# Altium project PCB.PrjPcb (part 1 of 2)
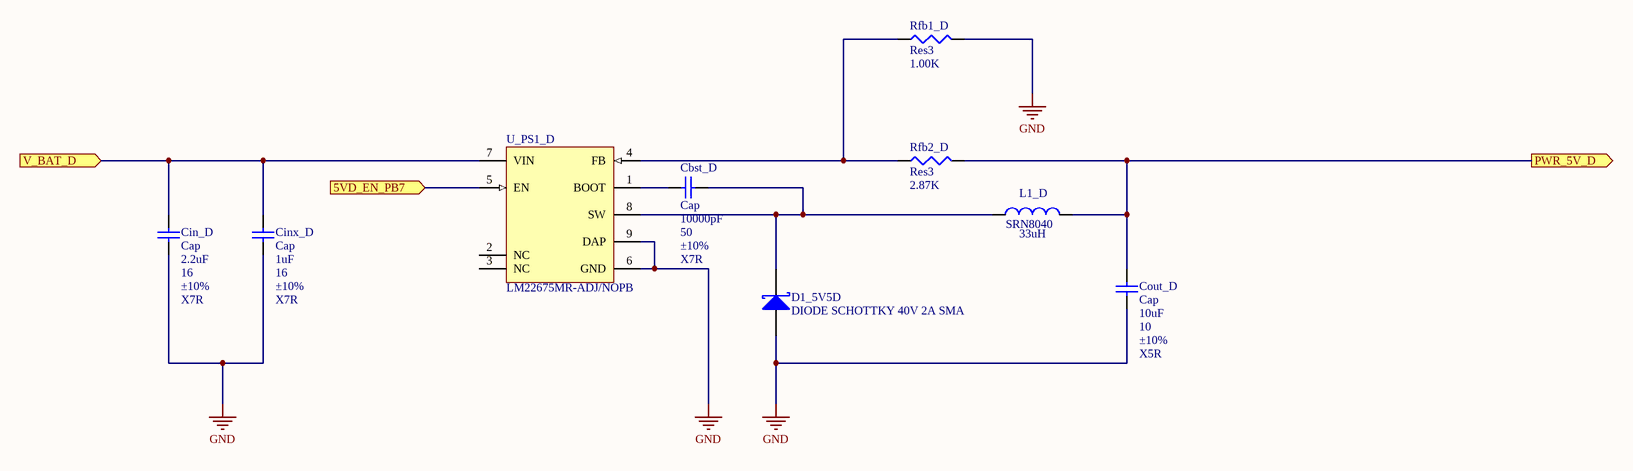
[diagram p0: SMPS_5V_D.SchDoc]
12 sheets, 134 parts. Net scope: hierarchical (ports join the sheet entries above them; power ports are global).
Board file: PCB1.PcbDoc
Sheets:
  SMPS_5V_D.SchDoc
  SMPS_5V_A.SchDoc
  Hierarchical_Design.SchDoc
    MCU = CPU.SchDoc
    Designator = RS3232.SchDoc
  StepperMotor1CTRL.SchDoc
  LCD_Header.SchDoc
  DCMotor1CTRL.SchDoc
  Encoder_DC_Mot.SchDoc
  LVR_3V3_PS.SchDoc
  Accelerometer.SchDoc
  DAC.SchDoc

## Sheet SMPS_5V_D.SchDoc: SMPS 5V Using LM22675
size B; Date: 2015-01-16; Author: Marcin Czajkowski; CompanyName: Conestoga College; DrawnBy: Marcin Czajkowski; Organization: Conestoga College; Address1: SN: 3547684; Address2: ESE-Y2; Address3: Conestoga College; Address4: Project IV; DocumentNumber: 1; Revision: A; SheetNumber: 3; SheetTotal: 14; ProjectName: SMPS 5V Using LM22675

### Parts
Cbst_D  Cap  value 10000pF  WV: 50  Tolerance: ±10%  Type: X7R  [CAPC2012X09M]
Cin_D  Cap  value 2.2uF  WV: 16  Tolerance: ±10%  Type: X7R  [CAPC2012X09M]
Cinx_D  Cap  value 1uF  WV: 16  Tolerance: ±10%  Type: X7R  [CAPC2012X09M]
Cout_D  Cap  value 10uF  WV: 10  Tolerance: ±10%  Type: X5R  [CAPC2012X09M]
D1_5V5D  DIODE SCHOTTKY 40V 2A SMA  [DIOM4326X23M]
L1_D  SRN8040  Val: 33uH  [INDP8080X40M]
Rfb1_D  Res3  value 1.00K  [RESC2112X05M]
Rfb2_D  Res3  value 2.87K  [RESC2112X05M]
U_PS1_D  LM22675MR-ADJ/NOPB  [MRA08B_L]

### Ports
5VD_EN_PB7 (in), PWR_5V_D (out), V_BAT_D (in)

### Nets
GND: Cin_D.1 Cinx_D.1 Cout_D.1 D1_5V5D.2(A) Rfb1_D.2 U_PS1_D.6(GND) U_PS1_D.9(DAP)
NetCbst_D_1: Cbst_D.1 U_PS1_D.1(BOOT)
NetCbst_D_2: Cbst_D.2 D1_5V5D.1(K) L1_D.1 U_PS1_D.8(SW)
NetCin_D_2: Cin_D.2 Cinx_D.2 U_PS1_D.7(VIN) ; port V_BAT_D
NetCout_D_2: Cout_D.2 L1_D.2 Rfb2_D.2 ; port PWR_5V_D
NetRfb1_D_1: Rfb1_D.1 Rfb2_D.1 U_PS1_D.4(FB)
NetU_PS1_D_5: U_PS1_D.5(EN) ; port 5VD_EN_PB7

Not connected (* = marked no-connect by the designer): U_PS1_D 2(NC) 3(NC)

### Notes on the sheet
- ESE
- is the sole property of ESE. Any reproduction
- The Information Contained in this drawing
- Schematic P/N and Name
- Sheet Name
- 299 Doon Valley Drive
- Kitchener, ON N2G 4M4
- Canada
- Approved
- in part or in whole without the written
- permission of ESE is strictly prohibited.
- APPROVALS
- DATE
- Size
- Scale
- B
- NTS
- Bare PCB P/N
- Date
- Sheet
- Rev.
- Checked
- Engineer
- of

### Library data of the parts
Cbst_D = CAP-X7R-10000pF-50V-±10%: CAP CER 10000pF 50v X7R 0805; MPN: C0805C103K5RACTU; PN: 399-1158-1-ND; Name: CAP-X7R-10000pF-50V-±10%; URL: http://www.digikey.ca/product-detail/en/C0805C103K5RACTU/399-1158-1-ND
Cin_D = CAP-X7R-2.2uF-16V-±10%: CAP CER 2.2uF 16v X7R 0805; MPN: C0805C225K4RACTU; PN: 399-3523-1-ND; Name: CAP-X7R-2.2uF-16V-±10%; URL: http://www.digikey.ca/product-detail/en/C0805C225K4RACTU/399-3523-1-ND
Cinx_D = CAP-X7R-1uF-16V-±10%: CAP CER 1uF 16v X7R 0805; MPN: C0805C105K4RACTU; PN: 399-1284-1-ND; Name: CAP-X7R-1uF-16V-±10%; URL: http://www.digikey.ca/product-detail/en/C0805C105K4RACTU/399-1284-1-ND
Cout_D = CAP-X5R-10uF-10V-±10%: CAP CER 10uF 10v X5R 0805; MPN: C0805C106K8PACTU; PN: 399-4925-1-ND; Name: CAP-X5R-10uF-10V-±10%; URL: http://www.digikey.ca/product-detail/en/C0805C106K8PACTU/399-4925-1-ND
D1_5V5D = DIODE SCHOTTKY 40V 2A SMA: Schottky Rectifier; MPN: B240A-13-F; PN: B240A-FDICT-ND; URL: http://www.digikey.ca/product-detail/en/B240A-13-F/B240A-FDICT-ND
L1_D = SRN8040: FIXED IND 33UH 1.7A 145 MOHM SMD; MPN: SRN8040-220M; PN: SRN8040-330MCT-ND; URL: http://www.digikey.ca/product-detail/en/SRN8040-330M/SRN8040-330MCT-ND/2756183
Rfb1_D = Resistor_1.00K: RES SMD 1.00K OHM 1% 1/8W 0805; MPN: CRCW08051K00FKEA; PN: 541-1.00KCCT-ND; Name: Resistor_1.00K; URL: http://www.digikey.ca/product-detail/en/CRCW08051K00FKEA/541-1.00KCCT-ND
Rfb2_D = Resistor_2.87K: RES SMD 2.87K OHM 1% 1/8W 0805; MPN: CRCW08052K87FKEA; PN: 541-2.87KCCT-ND; Name: Resistor_2.87K; URL: http://www.digikey.ca/product-detail/en/CRCW08052K87FKEA/541-2.87KCCT-ND
U_PS1_D = LM22675MR-ADJ/NOPB: 1A SIMPLE SWITCHER®, Step-Down Voltage Regulator with Precision Enable, 8-pin PSOP, Pb-Free; Manufacturer: National Semiconductor; MPN: LM22675MRE-ADJ/NOPB; PackageTopMarking: NSXYTT*L22675*ADJ; PowerWise: N; High-Reliability: Y; PN: LM22675MRE-ADJ/NOPBCT-ND; DatasheetVersion: Dec-2010; PackageVersion: revB, Dec-2007; PackageReference: MRA08B; PackageDescription: Molded, PSOP .193 x .154 x .058in, 8 Lead, .050in Pitch, Large DAP; PartNumber: LM22675MR-ADJ/NOPB; RoHS: Y; PinCount: 8; CompType: Switcher; Code_JEDEC: MS-012-AA; ComponentLink1Description: Manufacturer URL; ComponentLink1URL: http://www.national.com/; ComponentLink2Description: LM22675 Datasheet; ComponentLink2URL: http://www.national.com/ds/LM/LM22675.pdf; ComponentLink3Description: LM22675 Web Page; ComponentLink3URL: http://www.national.com/pf/LM/LM22675.html; ComponentLink4Description: MRA08B Package Page; ComponentLink4URL: http://www.national.com/packaging/folders/mra08b.html; URL: http://www.digikey.ca/product-detail/en/LM22675MRE-ADJ%2FNOPB/LM22675MRE-ADJ%2FNOPBCT-ND

## Sheet SMPS_5V_A.SchDoc: SMPS  5V Using LM22675
size B; Date: 2015-01-16; Author: Marcin Czajkowski; CompanyName: Conestoga College; DrawnBy: Marcin Czajkowski; Organization: Marcin Czajkowski; Address1: SN: 3547684; Address2: ESE-Y2; Address3: Conestoga College; Address4: Project IV; DocumentNumber: 1; Revision: A; SheetNumber: 4; SheetTotal: 14; ProjectName: SMPS  5V Using LM22675
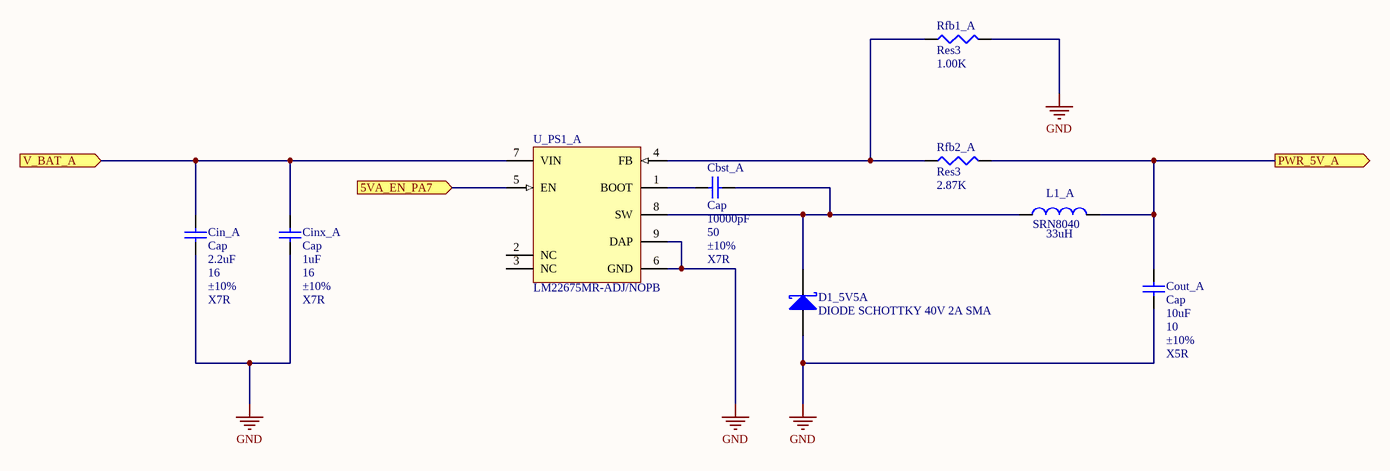
[diagram p1: SMPS_5V_A.SchDoc]

### Parts
Cbst_A  Cap  value 10000pF  WV: 50  Tolerance: ±10%  Type: X7R  [CAPC2012X09M]
Cin_A  Cap  value 2.2uF  WV: 16  Tolerance: ±10%  Type: X7R  [CAPC2012X09M]
Cinx_A  Cap  value 1uF  WV: 16  Tolerance: ±10%  Type: X7R  [CAPC2012X09M]
Cout_A  Cap  value 10uF  WV: 10  Tolerance: ±10%  Type: X5R  [CAPC2012X09M]
D1_5V5A  DIODE SCHOTTKY 40V 2A SMA  [DIOM4326X23M]
L1_A  SRN8040  Val: 33uH  [INDP8080X40M]
Rfb1_A  Res3  value 1.00K  [RESC2112X05M]
Rfb2_A  Res3  value 2.87K  [RESC2112X05M]
U_PS1_A  LM22675MR-ADJ/NOPB  [MRA08B_L]

### Ports
5VA_EN_PA7 (in), PWR_5V_A (out), V_BAT_A (in)

### Nets
GND: Cin_A.1 Cinx_A.1 Cout_A.1 D1_5V5A.2(A) Rfb1_A.2 U_PS1_A.6(GND) U_PS1_A.9(DAP)
NetCbst_A_1: Cbst_A.1 U_PS1_A.1(BOOT)
NetCbst_A_2: Cbst_A.2 D1_5V5A.1(K) L1_A.1 U_PS1_A.8(SW)
NetCin_A_2: Cin_A.2 Cinx_A.2 U_PS1_A.7(VIN) ; port V_BAT_A
NetCout_A_2: Cout_A.2 L1_A.2 Rfb2_A.2 ; port PWR_5V_A
NetRfb1_A_1: Rfb1_A.1 Rfb2_A.1 U_PS1_A.4(FB)
NetU_PS1_A_5: U_PS1_A.5(EN) ; port 5VA_EN_PA7

Not connected (* = marked no-connect by the designer): U_PS1_A 2(NC) 3(NC)

### Notes on the sheet
- ESE
- is the sole property of ESE. Any reproduction
- The Information Contained in this drawing
- Schematic P/N and Name
- Sheet Name
- 299 Doon Valley Drive
- Kitchener, ON N2G 4M4
- Canada
- Approved
- in part or in whole without the written
- permission of ESE is strictly prohibited.
- APPROVALS
- DATE
- Size
- Scale
- B
- NTS
- Bare PCB P/N
- Date
- Sheet
- Rev.
- Checked
- Engineer
- of

### Library data of the parts
Cbst_A = CAP-X7R-10000pF-50V-±10%: as Cbst_D on sheet SMPS_5V_D; Name: CAP-X7R-10000pF-50V-±10%; URL: http://www.digikey.ca/product-detail/en/C0805C103K5RACTU/399-1158-1-ND
Cin_A = CAP-X7R-2.2uF-16V-±10%: as Cin_D on sheet SMPS_5V_D; Name: CAP-X7R-2.2uF-16V-±10%; URL: http://www.digikey.ca/product-detail/en/C0805C225K4RACTU/399-3523-1-ND
Cinx_A = CAP-X7R-1uF-16V-±10%: as Cinx_D on sheet SMPS_5V_D; Name: CAP-X7R-1uF-16V-±10%; URL: http://www.digikey.ca/product-detail/en/C0805C105K4RACTU/399-1284-1-ND
Cout_A = CAP-X5R-10uF-10V-±10%: as Cout_D on sheet SMPS_5V_D; Name: CAP-X5R-10uF-10V-±10%; URL: http://www.digikey.ca/product-detail/en/C0805C106K8PACTU/399-4925-1-ND
D1_5V5A = DIODE SCHOTTKY 40V 2A SMA: as D1_5V5D on sheet SMPS_5V_D; URL: http://www.digikey.ca/product-detail/en/B240A-13-F/B240A-FDICT-ND
L1_A = SRN8040: as L1_D on sheet SMPS_5V_D; URL: http://www.digikey.ca/product-detail/en/SRN8040-330M/SRN8040-330MCT-ND/2756183
Rfb1_A = Resistor_1.00K: as Rfb1_D on sheet SMPS_5V_D; Name: Resistor_1.00K; URL: http://www.digikey.ca/product-detail/en/CRCW08051K00FKEA/541-1.00KCCT-ND
Rfb2_A = Resistor_2.87K: as Rfb2_D on sheet SMPS_5V_D; Name: Resistor_2.87K; URL: http://www.digikey.ca/product-detail/en/CRCW08052K87FKEA/541-2.87KCCT-ND
U_PS1_A = LM22675MR-ADJ/NOPB: as U_PS1_D on sheet SMPS_5V_D; DatasheetVersion: Dec-2010; PackageVersion: revB, Dec-2007; PackageReference: MRA08B; PackageDescription: Molded, PSOP .193 x .154 x .058in, 8 Lead, .050in Pitch, Large DAP; PartNumber: LM22675MR-ADJ/NOPB; RoHS: Y; PinCount: 8; CompType: Switcher; Code_JEDEC: MS-012-AA; ComponentLink1Description: Manufacturer URL; ComponentLink1URL: http://www.national.com/; ComponentLink2Description: LM22675 Datasheet; ComponentLink2URL: http://www.national.com/ds/LM/LM22675.pdf; ComponentLink3Description: LM22675 Web Page; ComponentLink3URL: http://www.national.com/pf/LM/LM22675.html; ComponentLink4Description: MRA08B Package Page; ComponentLink4URL: http://www.national.com/packaging/folders/mra08b.html; URL: http://www.digikey.ca/product-detail/en/LM22675MRE-ADJ%2FNOPB/LM22675MRE-ADJ%2FNOPBCT-ND

## Sheet Hierarchical_Design.SchDoc: Hierarchical Design HSC12
size B; Date: 2015-02-08; Author: Marcin Czajkowski; CompanyName: Conestoga College; DrawnBy: Marcin Czajkowski; Organization: Marcin Czajkowski; Address1: SN:3547684; Address2: ESE-Y2; Address3: Conestoga College; Address4: Project IV; DocumentNumber: 14; Revision: D; SheetNumber: 14; SheetTotal: 14; ProjectName: Hierarchical Design HSC12
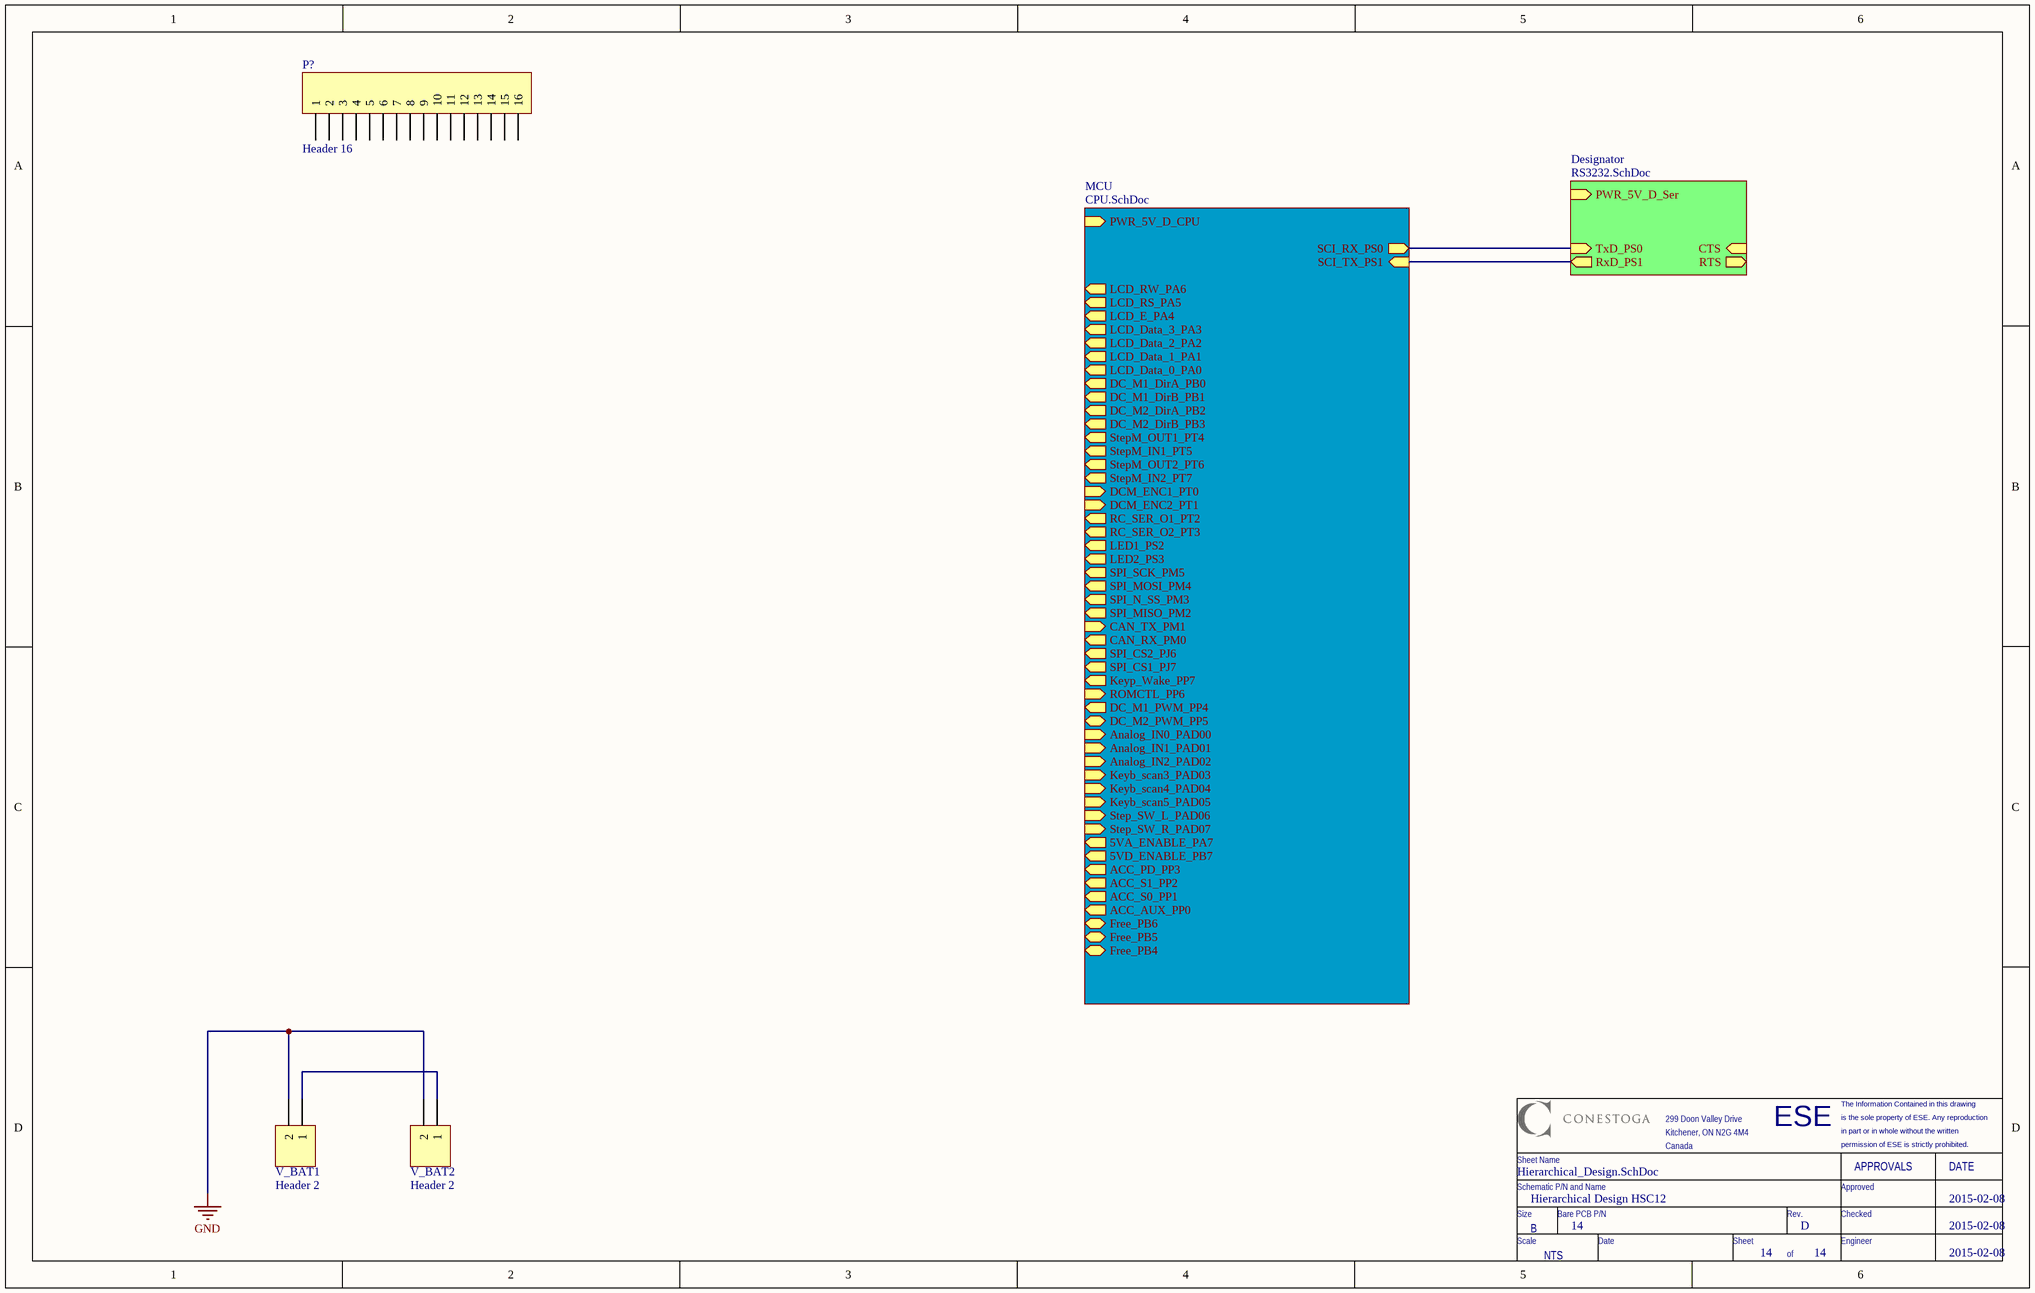
[diagram p2: Hierarchical_Design.SchDoc]

### Parts
P?  Header 16  [HDR1X16]
V_BAT1  Header 2  [HDR1X2]
V_BAT2  Header 2  [HDR1X2]

### Sub-sheets
Designator = RS3232.SchDoc: PWR_5V_D_Ser (in), TxD_PS0 (in), RxD_PS1 (out), CTS (in), RTS (out)
MCU = CPU.SchDoc: PWR_5V_D_CPU (in), SCI_RX_PS0 (out), SCI_TX_PS1 (in), LCD_RW_PA6 (out), LCD_RS_PA5 (out), LCD_E_PA4 (out), LCD_Data_3_PA3 (out), LCD_Data_2_PA2 (out), LCD_Data_1_PA1 (out), LCD_Data_0_PA0 (out), DC_M1_DirA_PB0 (out), DC_M1_DirB_PB1 (out), DC_M2_DirA_PB2 (out), DC_M2_DirB_PB3 (out), StepM_OUT1_PT4 (out), StepM_IN1_PT5 (out), StepM_OUT2_PT6 (out), StepM_IN2_PT7 (out), DCM_ENC1_PT0 (in), DCM_ENC2_PT1 (in), RC_SER_O1_PT2 (out), RC_SER_O2_PT3 (out), LED1_PS2 (out), LED2_PS3 (out), SPI_SCK_PM5 (out), SPI_MOSI_PM4 (out), SPI_N_SS_PM3 (out), SPI_MISO_PM2 (out), CAN_TX_PM1 (in), CAN_RX_PM0 (out), SPI_CS2_PJ6 (out), SPI_CS1_PJ7 (out), Keyp_Wake_PP7 (out), ROMCTL_PP6 (in), DC_M1_PWM_PP4 (out), DC_M2_PWM_PP5, Analog_IN0_PAD00 (in), Analog_IN1_PAD01 (in), Analog_IN2_PAD02 (in), Keyb_scan3_PAD03 (in), Keyb_scan4_PAD04 (in), Keyb_scan5_PAD05 (in), Step_SW_L_PAD06 (in), Step_SW_R_PAD07 (in), 5VA_ENABLE_PA7 (out), 5VD_ENABLE_PB7 (out), ACC_PD_PP3 (out), ACC_S1_PP2 (out), ACC_S0_PP1 (out), ACC_AUX_PP0 (out), Free_PB6 (bidir), Free_PB5 (bidir), Free_PB4 (bidir)

### Nets
GND: V_BAT1.2 V_BAT2.2
NetQ_RX_1: sheet MCU/SCI_TX_PS1, sheet Designator/RxD_PS1
NetQ_TX_1: sheet MCU/SCI_RX_PS0, sheet Designator/TxD_PS0
NetV_BAT1_1: V_BAT1.1 V_BAT2.1

Not connected (* = marked no-connect by the designer): P? 1 2 3 4 5 6 7 8 9 10 11 12 13 14 15 16

### Notes on the sheet
- ESE
- is the sole property of ESE. Any reproduction
- The Information Contained in this drawing
- Schematic P/N and Name
- Sheet Name
- 299 Doon Valley Drive
- Kitchener, ON N2G 4M4
- Canada
- Approved
- in part or in whole without the written
- permission of ESE is strictly prohibited.
- APPROVALS
- DATE
- Size
- Scale
- B
- NTS
- Bare PCB P/N
- Date
- Sheet
- Rev.
- Checked
- Engineer
- of

### Library data of the parts
P? = Header 16: Header, 16-Pin Female; MPN: PPPC161LFBN-RC; PN: S7049-ND; URL: http://www.digikey.ca/product-detail/en/PPPC161LFBN-RC/S7049-ND
V_BAT1 V_BAT2 = Header 2: Header, 2-Pin; MPN: PEC02SFAN; PN: S1212E-02-ND; URL: http://www.digikey.ca/product-detail/en/PEC04SFAN/S1212E-02-ND

## Sheet CPU.SchDoc: MC9S12C128 Connection Schematic
size B; Date: 2015-02-08; Author: Marcin Czajkowski; Organization: Marcin Czajkowski; Address1: SN:3547684; Address2: ESE - Year2; Address3: Conestoga College; Address4: Project IV; DocumentNumber: 1; Revision: D; SheetNumber: 1; SheetTotal: 14
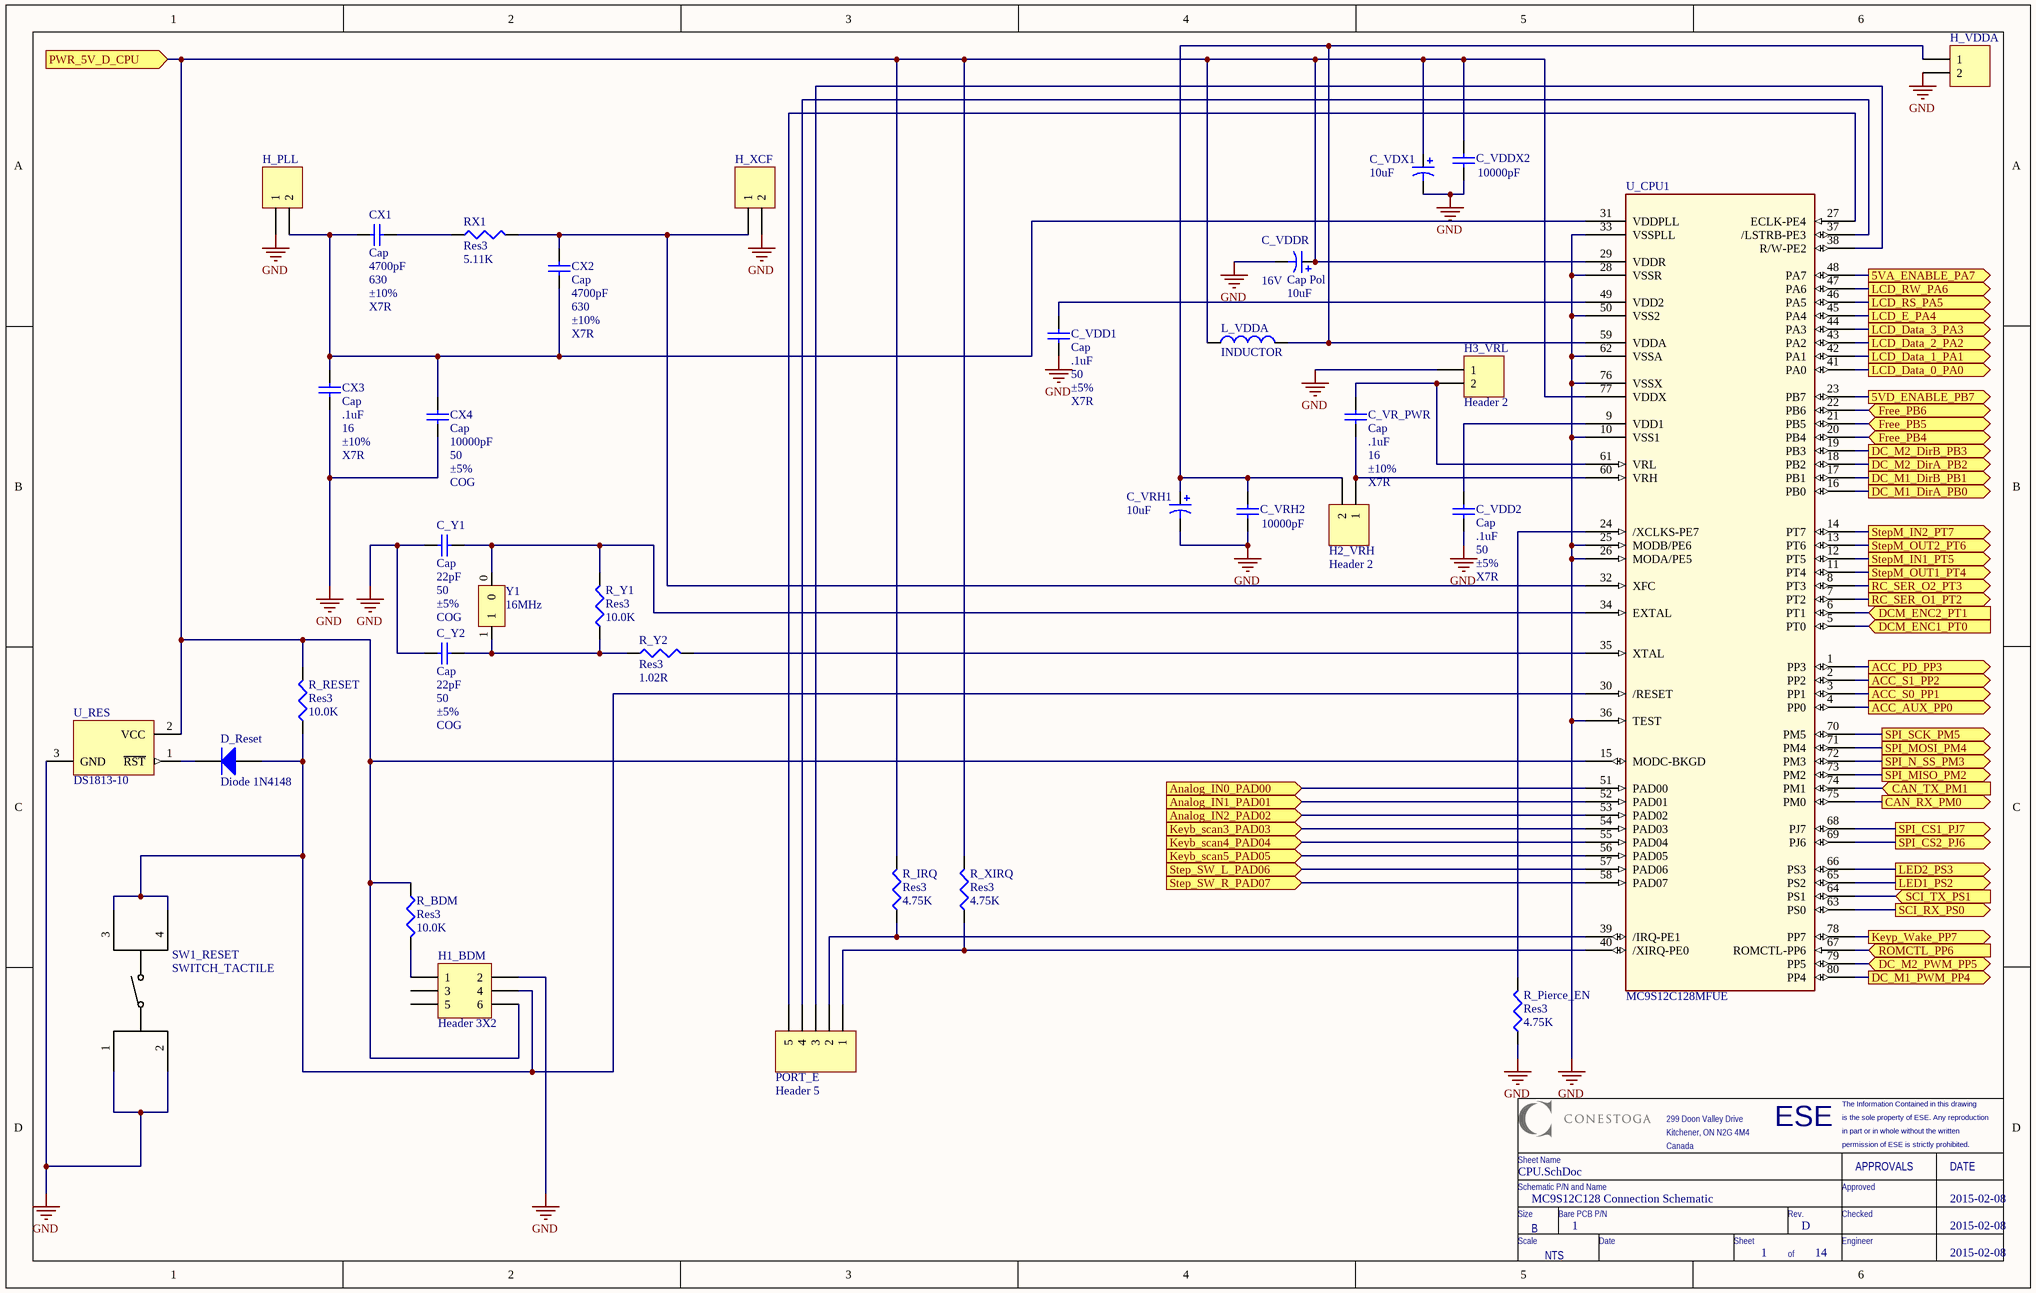
[diagram p3: CPU.SchDoc]

### Parts
C_VDD1  Cap  value .1uF  WV: 50  Tolerance: ±5%  Type: X7R  [CAPC2012X09M]
C_VDD2  Cap  value .1uF  WV: 50  Tolerance: ±5%  Type: X7R  [CAPC2012X09M]
C_VDDR  Cap Pol  value 10uF  Voltage: 16V  [CAPACITOR_3MM]
C_VDDX2  value 10000pF  [CAPC2012X09M]  (hidden comment: Cap)
C_VDX1  value 10uF  [CAPACITOR_3MM]  (hidden comment: Cap Pol)
C_VR_PWR  Cap  value .1uF  WV: 16  Tolerance: ±10%  Type: X7R  [CAPC2012X09M]
C_VRH1  value 10uF  [CAPACITOR_3MM]  (hidden comment: Cap Pol)
C_VRH2  value 10000pF  [CAPC2012X09M]  (hidden comment: Cap)
C_Y1  Cap  value 22pF  WV: 50  Tolerance: ±5%  Type: COG  [CAPC2012X09M]
C_Y2  Cap  value 22pF  WV: 50  Tolerance: ±5%  Type: COG  [CAPC2012X09M]
CX1  Cap  value 4700pF  WV: 630  Tolerance: ±10%  Type: X7R  [CAPC2012X09M]
CX2  Cap  value 4700pF  WV: 630  Tolerance: ±10%  Type: X7R  [CAPC2012X09M]
CX3  Cap  value .1uF  WV: 16  Tolerance: ±10%  Type: X7R  [CAPC2012X09M]
CX4  Cap  value 10000pF  WV: 50  Tolerance: ±5%  Type: COG  [CAPC2012X09M]
D_Reset  Diode 1N4148  [zener_sod323]
H1_BDM  Header 3X2  [HDR2X3]
H2_VRH  Header 2  [HDR1X2]
H3_VRL  Header 2  [HDR1X2]
H_PLL  Header 2  [HDR1X2]  (value not drawn)
H_VDDA  Header 2  [HDR1X2]  (value not drawn)
H_XCF  Header 2  [HDR1X2]  (value not drawn)
L_VDDA  INDUCTOR  [C1210]
PORT_E  Header 5  [HDR1X5]
R_BDM  Res3  value 10.0K  [RESC2112X05M]
R_IRQ  Res3  value 4.75K  [RESC2112X05M]
R_Pierce_EN  Res3  value 4.75K  [RESC2112X05M]
R_RESET  Res3  value 10.0K  [RESC2112X05M]
R_XIRQ  Res3  value 4.75K  [RESC2112X05M]
R_Y1  Res3  value 10.0K  [RESC2112X05M]
R_Y2  Res3  value 1.02R  [RESC2112X05M]
RX1  Res3  value 5.11K  [RESC2112X05M]
SW1_RESET  SWITCH_TACTILE  [TACT_SWITCH_6MM_SMT]
U_CPU1  MC9S12C128MFUE  [QUAD.65M/80/WG17.45-HCS12]
U_RES  DS1813-10  [SOT95P230X110-3M]
Y1  value 16MHz  [PCBComponent_1]  (hidden comment: ECS-160-20-5P)

### Ports
5VA_ENABLE_PA7 (out), 5VD_ENABLE_PB7 (out), ACC_AUX_PP0 (out), ACC_PD_PP3 (out), ACC_S0_PP1 (out), ACC_S1_PP2 (out), Analog_IN0_PAD00 (in), Analog_IN1_PAD01 (in), Analog_IN2_PAD02 (in), CAN_RX_PM0 (out), CAN_TX_PM1 (in), DC_M1_DirA_PB0 (out), DC_M1_DirB_PB1 (out), DC_M1_PWM_PP4 (out), DC_M2_DirA_PB2 (out), DC_M2_DirB_PB3 (out), DC_M2_PWM_PP5, DCM_ENC1_PT0 (in), DCM_ENC2_PT1 (in), Free_PB4 (bidir), Free_PB5 (bidir), Free_PB6 (bidir), Keyb_scan3_PAD03 (in), Keyb_scan4_PAD04 (in), Keyb_scan5_PAD05 (in), Keyp_Wake_PP7 (out), LCD_Data_0_PA0 (out), LCD_Data_1_PA1 (out), LCD_Data_2_PA2 (out), LCD_Data_3_PA3 (out), LCD_E_PA4 (out), LCD_RS_PA5 (out), LCD_RW_PA6 (out), LED1_PS2 (out), LED2_PS3 (out), PWR_5V_D_CPU (in), RC_SER_O1_PT2 (out), RC_SER_O2_PT3 (out), ROMCTL_PP6 (in), SCI_RX_PS0 (out), SCI_TX_PS1 (in), SPI_CS1_PJ7 (out), SPI_CS2_PJ6 (out), SPI_MISO_PM2 (out), SPI_MOSI_PM4 (out), SPI_N_SS_PM3 (out), SPI_SCK_PM5 (out), Step_SW_L_PAD06 (in), Step_SW_R_PAD07 (in), StepM_IN1_PT5 (out), StepM_IN2_PT7 (out), StepM_OUT1_PT4 (out), StepM_OUT2_PT6 (out)

### Nets
GND: C_VDD1.1 C_VDD2.1 C_VDDR.2 C_VDDX2.1 C_VDX1.2 C_VRH1.2 C_VRH2.1 C_Y1.1 C_Y2.1 CX3.1 CX4.1 H1_BDM.2 H3_VRL.1 H_PLL.1 H_VDDA.2 H_XCF.2 R_Pierce_EN.1 SW1_RESET.1 SW1_RESET.2 U_CPU1.10(VSS1) U_CPU1.25(MODB/PE6) U_CPU1.26(MODA/PE5) U_CPU1.28(VSSR) U_CPU1.33(VSSPLL) U_CPU1.36(TEST) U_CPU1.50(VSS2) U_CPU1.62(VSSA) U_CPU1.76(VSSX) U_RES.3(GND)
NetC_VDD1_2: C_VDD1.2 U_CPU1.49(VDD2)
NetC_VDD2_2: C_VDD2.2 U_CPU1.9(VDD1)
NetC_VDDR_1: C_VDDR.1 C_VDDX2.2 C_VDX1.1 H1_BDM.6 L_VDDA.1 R_BDM.1 R_IRQ.2 R_RESET.2 R_XIRQ.2 U_CPU1.15(MODC-BKGD) U_CPU1.29(VDDR) U_CPU1.77(VDDX) U_RES.2(VCC) ; port PWR_5V_D_CPU
NetC_VR_PWR_1: C_VR_PWR.1 H2_VRH.1 U_CPU1.60(VRH)
NetC_VR_PWR_2: C_VR_PWR.2 H3_VRL.2 U_CPU1.61(VRL)
NetC_VRH1_1: C_VRH1.1 C_VRH2.2 H2_VRH.2 H_VDDA.1 L_VDDA.2 U_CPU1.59(VDDA)
NetC_Y1_2: C_Y1.2 R_Y1.2 U_CPU1.34(EXTAL) Y1.0
NetC_Y2_2: C_Y2.2 R_Y1.1 R_Y2.1 Y1.1
NetCX1_1: CX1.1 CX2.1 CX3.2 CX4.2 H_PLL.2 U_CPU1.31(VDDPLL)
NetCX1_2: CX1.2 RX1.1
NetCX2_2: CX2.2 H_XCF.1 RX1.2 U_CPU1.32(XFC)
NetD_Reset_A: D_Reset.A H1_BDM.4 R_RESET.1 SW1_RESET.3 SW1_RESET.4 U_CPU1.30(/RESET)
NetD_Reset_K: D_Reset.K U_RES.1(~{RST})
NetH1_BDM_1: H1_BDM.1 R_BDM.2
NetPORT_E_1: PORT_E.1 R_XIRQ.1 U_CPU1.40(/XIRQ-PE0)
NetPORT_E_2: PORT_E.2 R_IRQ.1 U_CPU1.39(/IRQ-PE1)
NetPORT_E_3: PORT_E.3 U_CPU1.38(R/W-PE2)
NetPORT_E_4: PORT_E.4 U_CPU1.37(/LSTRB-PE3)
NetPORT_E_5: PORT_E.5 U_CPU1.27(ECLK-PE4)
NetQ_RX_1: U_CPU1.64(PS1) ; port SCI_TX_PS1
NetQ_TX_1: U_CPU1.63(PS0) ; port SCI_RX_PS0
NetR_Pierce_EN_2: R_Pierce_EN.2 U_CPU1.24(/XCLKS-PE7)
NetR_Y2_2: R_Y2.2 U_CPU1.35(XTAL)
NetU_CPU1_1: U_CPU1.1(PP3) ; port ACC_PD_PP3
NetU_CPU1_2: U_CPU1.2(PP2) ; port ACC_S1_PP2
NetU_CPU1_3: U_CPU1.3(PP1) ; port ACC_S0_PP1
NetU_CPU1_4: U_CPU1.4(PP0) ; port ACC_AUX_PP0
NetU_CPU1_5: U_CPU1.5(PT0) ; port DCM_ENC1_PT0
NetU_CPU1_6: U_CPU1.6(PT1) ; port DCM_ENC2_PT1
NetU_CPU1_7: U_CPU1.7(PT2) ; port RC_SER_O1_PT2
NetU_CPU1_8: U_CPU1.8(PT3) ; port RC_SER_O2_PT3
NetU_CPU1_11: U_CPU1.11(PT4) ; port StepM_OUT1_PT4
NetU_CPU1_12: U_CPU1.12(PT5) ; port StepM_IN1_PT5
NetU_CPU1_13: U_CPU1.13(PT6) ; port StepM_OUT2_PT6
NetU_CPU1_14: U_CPU1.14(PT7) ; port StepM_IN2_PT7
NetU_CPU1_16: U_CPU1.16(PB0) ; port DC_M1_DirA_PB0
NetU_CPU1_17: U_CPU1.17(PB1) ; port DC_M1_DirB_PB1
NetU_CPU1_18: U_CPU1.18(PB2) ; port DC_M2_DirA_PB2
NetU_CPU1_19: U_CPU1.19(PB3) ; port DC_M2_DirB_PB3
NetU_CPU1_20: U_CPU1.20(PB4) ; port Free_PB4
NetU_CPU1_21: U_CPU1.21(PB5) ; port Free_PB5
NetU_CPU1_22: U_CPU1.22(PB6) ; port Free_PB6
NetU_CPU1_23: U_CPU1.23(PB7) ; port 5VD_ENABLE_PB7
NetU_CPU1_41: U_CPU1.41(PA0) ; port LCD_Data_0_PA0
NetU_CPU1_42: U_CPU1.42(PA1) ; port LCD_Data_1_PA1
NetU_CPU1_43: U_CPU1.43(PA2) ; port LCD_Data_2_PA2
NetU_CPU1_44: U_CPU1.44(PA3) ; port LCD_Data_3_PA3
NetU_CPU1_45: U_CPU1.45(PA4) ; port LCD_E_PA4
NetU_CPU1_46: U_CPU1.46(PA5) ; port LCD_RS_PA5
NetU_CPU1_47: U_CPU1.47(PA6) ; port LCD_RW_PA6
NetU_CPU1_48: U_CPU1.48(PA7) ; port 5VA_ENABLE_PA7
NetU_CPU1_51: U_CPU1.51(PAD00) ; port Analog_IN0_PAD00
NetU_CPU1_52: U_CPU1.52(PAD01) ; port Analog_IN1_PAD01
NetU_CPU1_53: U_CPU1.53(PAD02) ; port Analog_IN2_PAD02
NetU_CPU1_54: U_CPU1.54(PAD03) ; port Keyb_scan3_PAD03
NetU_CPU1_55: U_CPU1.55(PAD04) ; port Keyb_scan4_PAD04
NetU_CPU1_56: U_CPU1.56(PAD05) ; port Keyb_scan5_PAD05
NetU_CPU1_57: U_CPU1.57(PAD06) ; port Step_SW_L_PAD06
NetU_CPU1_58: U_CPU1.58(PAD07) ; port Step_SW_R_PAD07
NetU_CPU1_65: U_CPU1.65(PS2) ; port LED1_PS2
NetU_CPU1_66: U_CPU1.66(PS3) ; port LED2_PS3
NetU_CPU1_67: U_CPU1.67(ROMCTL-PP6) ; port ROMCTL_PP6
NetU_CPU1_68: U_CPU1.68(PJ7) ; port SPI_CS1_PJ7
NetU_CPU1_69: U_CPU1.69(PJ6) ; port SPI_CS2_PJ6
NetU_CPU1_70: U_CPU1.70(PM5) ; port SPI_SCK_PM5
NetU_CPU1_71: U_CPU1.71(PM4) ; port SPI_MOSI_PM4
NetU_CPU1_72: U_CPU1.72(PM3) ; port SPI_N_SS_PM3
NetU_CPU1_73: U_CPU1.73(PM2) ; port SPI_MISO_PM2
NetU_CPU1_74: U_CPU1.74(PM1) ; port CAN_TX_PM1
NetU_CPU1_75: U_CPU1.75(PM0) ; port CAN_RX_PM0
NetU_CPU1_78: U_CPU1.78(PP7) ; port Keyp_Wake_PP7
NetU_CPU1_79: U_CPU1.79(PP5) ; port DC_M2_PWM_PP5
NetU_CPU1_80: U_CPU1.80(PP4) ; port DC_M1_PWM_PP4

Not connected (* = marked no-connect by the designer): H1_BDM 3 5

### Notes on the sheet
- ESE
- is the sole property of ESE. Any reproduction
- The Information Contained in this drawing
- Schematic P/N and Name
- Sheet Name
- 299 Doon Valley Drive
- Kitchener, ON N2G 4M4
- Canada
- Approved
- in part or in whole without the written
- permission of ESE is strictly prohibited.
- APPROVALS
- DATE
- Size
- Scale
- B
- NTS
- Bare PCB P/N
- Date
- Sheet
- Rev.
- Checked
- Engineer
- of

### Library data of the parts
C_VDD1 C_VDD2 = CAP-X7R-.1uF-50V-±5%: CAP CER .1uF 50v X7R 0805; MPN: C0805C104J5RACTU; PN: 399-1171-1-ND; Name: CAP-X7R-.1uF-50V-±5%; URL: http://www.digikey.ca/product-detail/en/C0805C104J5RACTU/399-1171-1-ND
C_VDDR C_VDX1 C_VRH1 = Cap Polar-10uF-16V: CAP 85C 10uF ±20% 16V WX Series Aluminum Electrolytic; MPN: UWX1C100MCL2GB; Tan Theta: 0.16; Leakage Current: 3; Rated Ripple Current: 18; PN: 493-2099-1-ND; Name: Cap Polar-10uF-16V; Diameter: 3; URL: http://www.digikey.ca/product-detail/en/UWX1C100MCL2GB/493-2099-1-ND
  C_VDX1 C_VRH1: Voltage: 16V
C_VDDX2 C_VRH2 = CAP-X7R-10000pF-50V-±10%: CAP CER 10000pF 50v X7R 0805; MPN: C0805C103K5RACTU; WV: 50; Tolerance: ±10%; PN: 399-1158-1-ND; Name: CAP-X7R-10000pF-50V-±10%; Type: X7R; URL: http://www.digikey.ca/product-detail/en/C0805C103K5RACTU/399-1158-1-ND
C_VR_PWR CX3 = CAP-X7R-.1uF-16V-±10%: CAP CER .1uF 16v X7R 0805; MPN: C0805C104K4RACTU; PN: 399-1167-1-ND; Name: CAP-X7R-.1uF-16V-±10%; URL: http://www.digikey.ca/product-detail/en/C0805C104K4RACTU/399-1167-1-ND
C_Y1 C_Y2 = CAP-COG-22pF-50V-±5%: CAP CER 22pF 50v COG 0805; MPN: C0805C220J5GACTU; PN: 399-1113-1-ND; Name: CAP-COG-22pF-50V-±5%; URL: http://www.digikey.ca/product-detail/en/C0805C220J5GACTU/399-1113-1-ND
CX1 CX2 = CAP-X7R-4700pF-630V-±10%: CAP CER 4700pF 630v X7R 1210; MPN: C1210C472KBRACTU; PN: 399-5595-1-ND; Name: CAP-X7R-4700pF-630V-±10%; URL: http://www.digikey.ca/product-detail/en/C1210C472KBRACTU/399-5595-1-ND
CX4 = CAP-COG-10000pF-50V-±5%: CAP CER 10000pF 50v COG 1210; MPN: C1210C103J5GACTU; PN: 399-1266-1-ND; Name: CAP-COG-10000pF-50V-±5%; URL: http://www.digikey.ca/product-detail/en/C1210C103J5GACTU/399-1266-1-ND
D_Reset = Diode 1N4148: High Conductance Fast Diode; MPN: 1N4148WX-TP; PN: 1N4148WXTPMSCT-ND; URL: http://www.digikey.ca/product-detail/en/1N4148WX-TP/1N4148WXTPMSCT-ND
H1_BDM = Header 3X2: Header, 3-Pin, Dual row; LatestRevisionDate: 17-Jul-2002; LatestRevisionNote: Re-released for DXP Platform.; Publisher: Altium Limited; DigikeyWeb: http://www.digikey.ca/product-detail/en/M20-9980346/952-2121-ND/3728085; Digikey#: 952-2121-ND
H2_VRH H3_VRL H_PLL H_VDDA H_XCF = Header 2: as V_BAT1 on sheet Hierarchical_Design; URL: http://www.digikey.ca/product-detail/en/PEC04SFAN/S1212E-02-ND
PORT_E = Header 5: Header, 5-Pin; MPN: PEC05SFAN; PN: S1212E-05-ND; URL: http://www.digikey.ca/product-detail/en/PEC05SFAN/S1212E-05-ND/859446
R_BDM R_RESET R_Y1 = Resistor_10.0K: RES SMD 10.0K OHM 1% 1/8W 0805; MPN: CRCW080510K0FKEA; PN: 541-10.0KCCT-ND; Name: Resistor_10.0K; URL: http://www.digikey.ca/product-detail/en/CRCW080510K0FKEA/541-10.0KCCT-ND
R_IRQ R_Pierce_EN R_XIRQ = Resistor_4.75K: RES SMD 4.75K OHM 1% 1/8W 0805; MPN: CRCW08054K75FKEA; PN: 541-4.75KCCT-ND; Name: Resistor_4.75K; URL: http://www.digikey.ca/product-detail/en/CRCW08054K75FKEA/541-4.75KCCT-ND
R_Y2 = Resistor_1.02R: RES SMD 1.02R OHM 1% 1/8W 0805; MPN: CRCW08051R02FKEA; PN: 541-1.02CCCT-ND; Name: Resistor_1.02R; URL: http://www.digikey.ca/product-detail/en/CRCW08051R02FKEA/541-1.02CCCT-ND
RX1 = Resistor_5.11K: RES SMD 5.11K OHM 1% 1/8W 0805; MPN: CRCW08055K11FKEA; PN: 541-5.11KCCT-ND; Name: Resistor_5.11K; URL: http://www.digikey.ca/product-detail/en/CRCW08055K11FKEA/541-5.11KCCT-ND
SW1_RESET = SWITCH_TACTILE: SWITCH TACTILE SPST-NO 0.05A 12V; MPN: PTS645SH50SMTR92 LFS; PN: CKN9085CT-ND; URL: http://www.digikey.ca/product-detail/en/PTS645SH50SMTR92%20LFS/CKN9085CT-ND
U_CPU1 = MC9S12C128MFUE: IC MCU 16BIT 128KB FLASH 80QFP; MPN: MC9S12C32CFUE25; PN: MC9S12C32CFUE25-ND; URL: http://www.digikey.ca/product-detail/en/MC9S12C32CFUE25/MC9S12C32CFUE25-ND
U_RES = DS1813-10: 5V EconoReset with Pushbutton; MPN: DS1813R-10+T&R; PN: DS1813R-10+T&RCT-ND; Published: 13-Oct-2000; LatestRevisionDate: 17-Jul-2002; LatestRevisionNote: Re-released for DXP Platform.; DatasheetVersion: 7-May-1998; PackageVersion: Feb-1999; PackageReference: TO-92; Publisher: Altium Limited; PackageDescription: TO, Flat Index; 3 In-Line, Axial Leads; Body Dia. 4.7mm; Leads 0.56 x 0.51 mm (max); ComponentLink1Description: Manufacturer Link; ComponentLink1URL: http://www.maxim-ic.com/; ComponentLink2Description: Datasheet; ComponentLink2URL: http://pdfserv.maxim-ic.com/en/ds/DS1813.pdf; URL: http://www.digikey.ca/product-detail/en/DS1813R-10%2BT%26R/DS1813R-10%2BT%26RCT-ND
L_VDDA = INDUCTOR: DigikeyWeb: http://www.digikey.ca/product-detail/en/IMC1210SY100K/541-1673-1-ND/3622241; Digikey#: 541-1673-1-ND
Y1 = ECS-160-20-5P: DigikeyWeb: http://www.digikey.ca/product-detail/en/ECS-160-20-5P-TR/XC694CT-ND/38747; Digikey#: XC694CT-ND

## Sheet RS3232.SchDoc: Serial Connection Using RS3232
size B; Date: 2015-01-16; Author: Marcin Czajkowski; CompanyName: Conestoga College; DrawnBy: Marcin Czajkowski; Organization: Marcin Czajkowski; Address1: SN: 3547684; Address2: ESE-Y2; Address3: Conestoga College; Address4: Project IV; DocumentNumber: 1; Revision: A; SheetNumber: 2; SheetTotal: 14; ProjectName: Serial Connection Using RS3232
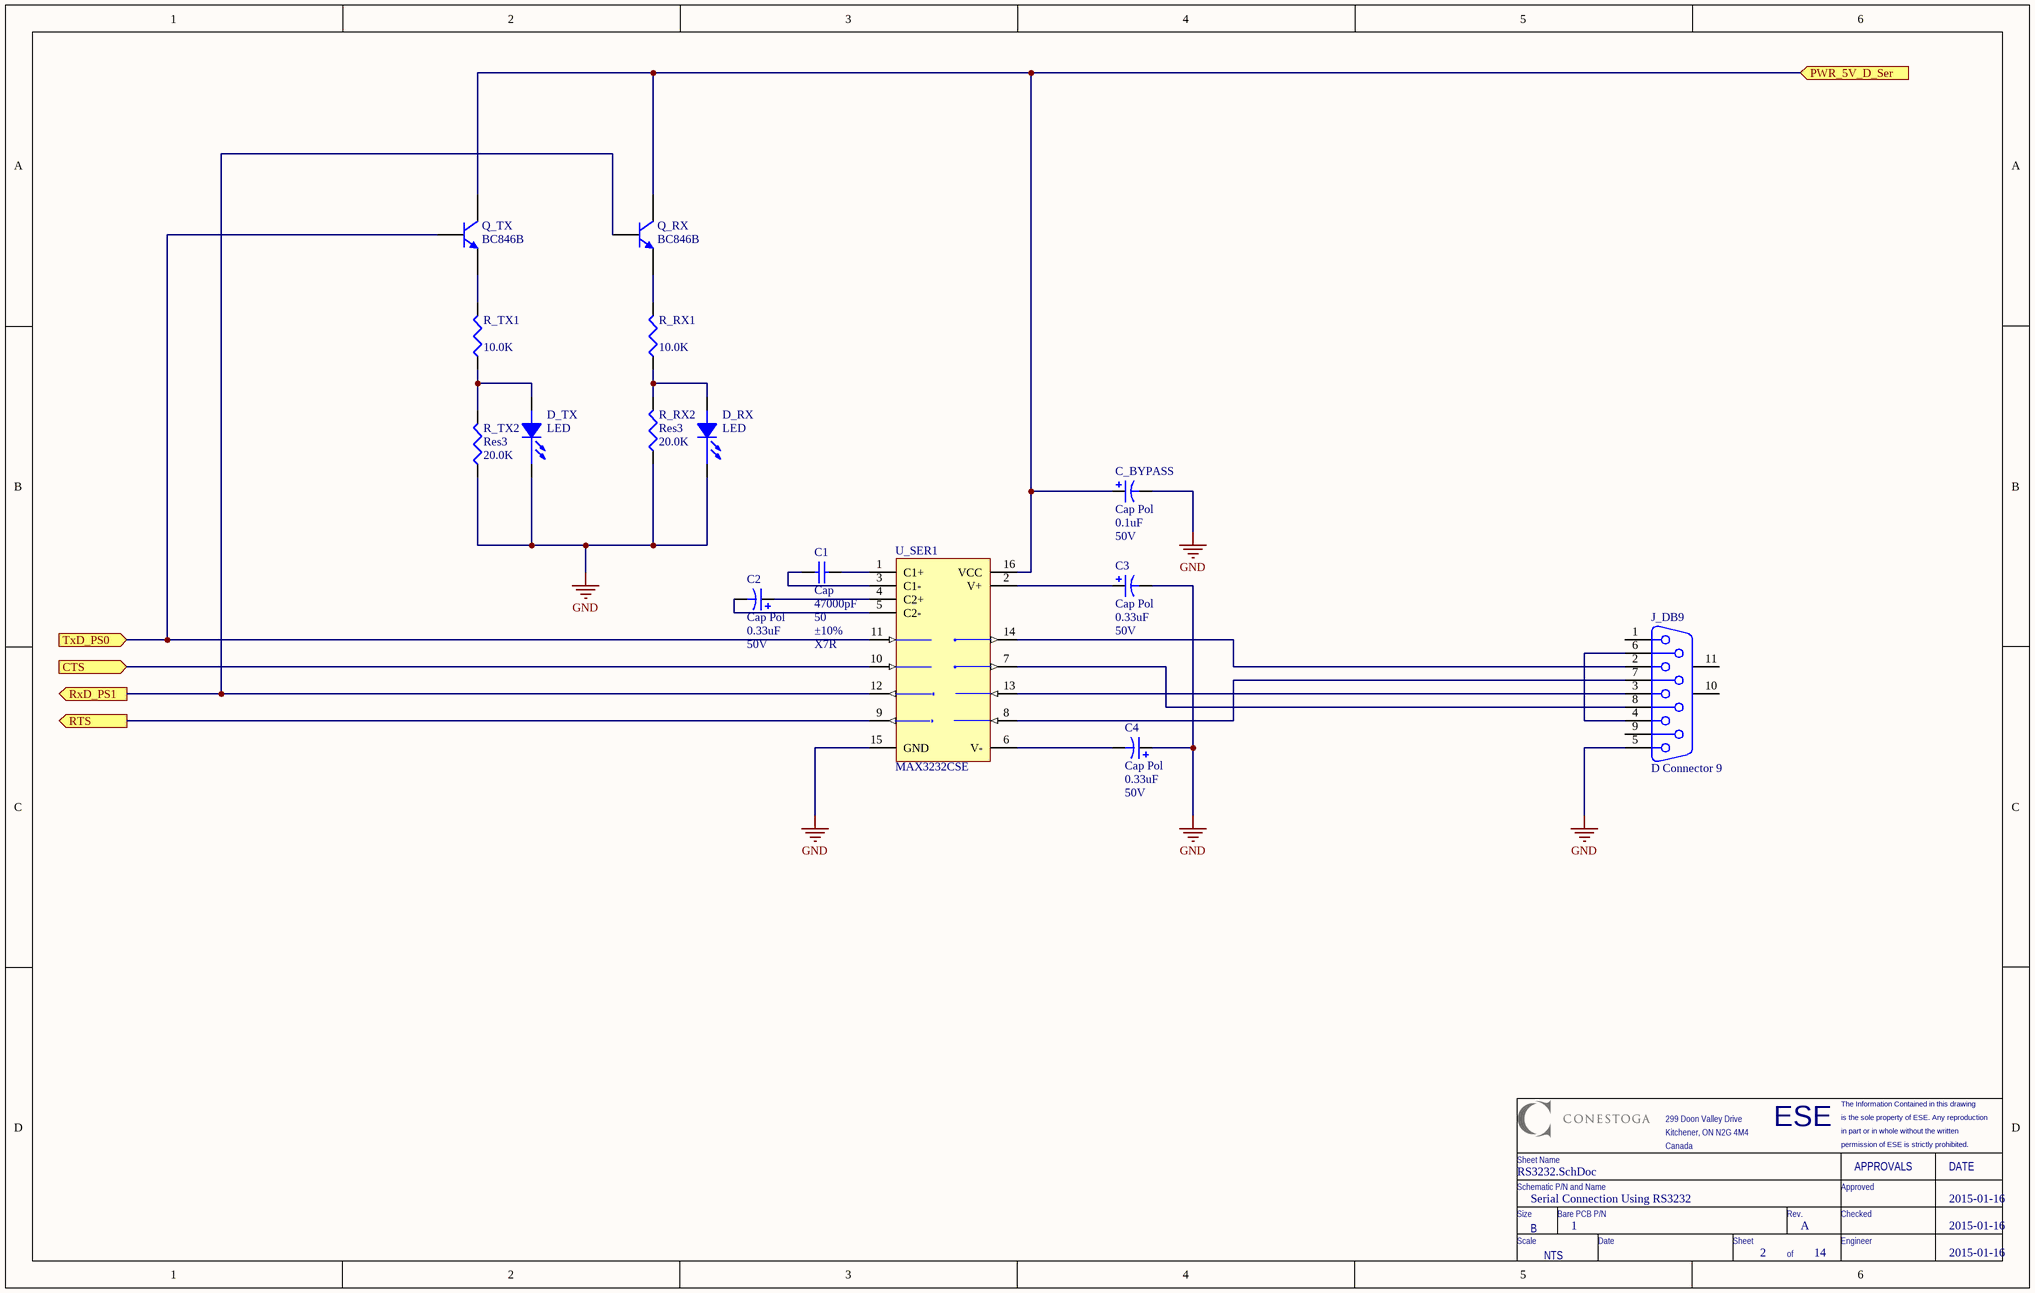
[diagram p4: RS3232.SchDoc]

### Parts
C1  Cap  value 47000pF  WV: 50  Tolerance: ±10%  Type: X7R  [CAPC2012X09M]
C2  Cap Pol  value 0.33uF  Voltage: 50V  [CAPACITOR_3MM]
C3  Cap Pol  value 0.33uF  Voltage: 50V  [CAPACITOR_3MM]
C4  Cap Pol  value 0.33uF  Voltage: 50V  [CAPACITOR_3MM]
C_BYPASS  Cap Pol  value 0.1uF  Voltage: 50V  [CAPACITOR_3MM]
D_RX  LED  [0603]
D_TX  LED  [0603]
J_DB9  D Connector 9  [DSUB1.385-2H9]
Q_RX  BC846B  [SOT95P230X110-3M]
Q_TX  BC846B  [SOT95P230X110-3M]
R_RX1  value 10.0K  [RESC2112X05M]  (hidden comment: Res3)
R_RX2  Res3  value 20.0K  [RESC2112X05M]
R_TX1  value 10.0K  [RESC2112X05M]  (hidden comment: Res3)
R_TX2  Res3  value 20.0K  [RESC2112X05M]
U_SER1  MAX3232CSE  [NSO16_N]

### Ports
CTS (in), PWR_5V_D_Ser (in), RTS (out), RxD_PS1 (out), TxD_PS0 (in)

### Nets
GND: C3.2 C4.1 C_BYPASS.2 D_RX.2(C) D_TX.2(C) J_DB9.5 R_RX2.1 R_TX2.1 U_SER1.15(GND)
NetC1_1: C1.1 U_SER1.3(C1-)
NetC1_2: C1.2 U_SER1.1(C1+)
NetC2_1: C2.1 U_SER1.4(C2+)
NetC2_2: C2.2 U_SER1.5(C2-)
NetC3_1: C3.1 U_SER1.2(V+)
NetC4_2: C4.2 U_SER1.6(V-)
NetC_BYPASS_1: C_BYPASS.1 Q_RX.3(C) Q_TX.3(C) U_SER1.16(VCC) ; port PWR_5V_D_Ser
NetD_RX_1: D_RX.1(A) R_RX1.1 R_RX2.2
NetD_TX_1: D_TX.1(A) R_TX1.1 R_TX2.2
NetJ_DB9_2: J_DB9.2 U_SER1.14(T1OUT)
NetJ_DB9_3: J_DB9.3 U_SER1.13(R1IN)
NetJ_DB9_4: J_DB9.4 J_DB9.6
NetJ_DB9_7: J_DB9.7 U_SER1.8(R2IN)
NetJ_DB9_8: J_DB9.8 U_SER1.7(T2OUT)
NetQ_RX_1: Q_RX.1(B) U_SER1.12(R1OUT) ; port RxD_PS1
NetQ_RX_2: Q_RX.2(E) R_RX1.2
NetQ_TX_1: Q_TX.1(B) U_SER1.11(T1IN) ; port TxD_PS0
NetQ_TX_2: Q_TX.2(E) R_TX1.2
NetU_SER1_9: U_SER1.9(R2OUT) ; port RTS
NetU_SER1_10: U_SER1.10(T2IN) ; port CTS

Not connected (* = marked no-connect by the designer): J_DB9 1 9 10(MH1) 11(MH2)

### Notes on the sheet
- ESE
- is the sole property of ESE. Any reproduction
- The Information Contained in this drawing
- Schematic P/N and Name
- Sheet Name
- 299 Doon Valley Drive
- Kitchener, ON N2G 4M4
- Canada
- Approved
- in part or in whole without the written
- permission of ESE is strictly prohibited.
- APPROVALS
- DATE
- Size
- Scale
- B
- NTS
- Bare PCB P/N
- Date
- Sheet
- Rev.
- Checked
- Engineer
- of

### Library data of the parts
C1 = CAP-X7R-47000pF-50V-±10%: CAP CER 47000pF 50v X7R 0805; MPN: C0805C473K5RACTU; PN: 399-1166-1-ND; Name: CAP-X7R-47000pF-50V-±10%; URL: http://www.digikey.ca/product-detail/en/C0805C473K5RACTU/399-1166-1-ND
C2-C4 = Cap Polar-0.33uF-50V: CAP 85C 0.33uF ±20% 50V WX Series Aluminum Electrolytic; MPN: UWX1HR33MCL2GB; Tan Theta: 0.12; Leakage Current: 3; Rated Ripple Current: 2.8; PN: 493-2125-1-ND; Name: Cap Polar-0.33uF-50V; Diameter: 3; URL: http://www.digikey.ca/product-detail/en/UWX1HR33MCL2GB/493-2125-1-ND
C_BYPASS = Cap Polar-0.1uF-50V: CAP 85C 0.1uF ±20% 50V WX Series Aluminum Electrolytic; MPN: UWX1H0R1MCL2GB; Tan Theta: 0.12; Leakage Current: 3; Rated Ripple Current: 1; PN: 493-2121-1-ND; Name: Cap Polar-0.1uF-50V; Diameter: 3; URL: http://www.digikey.ca/product-detail/en/UWX1H0R1MCL2GB/493-2121-1-ND
J_DB9 = D Connector 9: Receptacle Assembly, 9 Position, Right Angle; MPN: ADF09A-KG-TASB3-R; PN: AE10921-ND; URL: http://www.digikey.ca/product-detail/en/ADF09A-KG-TASB3-R/AE10921-ND
Q_RX Q_TX = BC846B: NPN General Purpose Amplifier; PN: 568-1632-1-ND; URL: http://www.digikey.ca/product-detail/en/BC846B,215/568-1632-1-ND/763459
R_RX1 R_TX1 = Resistor_10.0K: as R_BDM on sheet CPU; Name: Resistor_10.0K; URL: http://www.digikey.ca/product-detail/en/CRCW080510K0FKEA/541-10.0KCCT-ND
R_RX2 R_TX2 = Resistor_20.0K: RES SMD 20.0K OHM 1% 1/8W 0805; MPN: CRCW080520K0FKEA; PN: 541-20.0KCCT-ND; Name: Resistor_20.0K; URL: http://www.digikey.ca/product-detail/en/CRCW080520K0FKEA/541-20.0KCCT-ND
U_SER1 = MAX3232CSE: 3.0V TO 5.5V, Low-Power, up to 1Mbps, True RS-232 Transceiver Using Four 0.1µF External Capacitor; MPN: MAX3232CSE+; PN: MAX3232CSE+-ND; Published: 16-Jan-2001; LatestRevisionDate: 13-Apr-2006; LatestRevisionNote: IPC-7351 Footprint Added.; DatasheetVersion: Mar-1999; PackageReference: NSO16; Publisher: Altium Limited; PackageDescription: 16-Pin Small Outline Integrated Circuit 1.27 mm Pitch; Code_JEDEC: MS-012-AC; Code_IPC: SOIC127P600-16; ComponentLink1Description: Manufacturer Link; ComponentLink1URL: http://www.maxim-ic.com/; ComponentLink2Description: Datasheet; ComponentLink2URL: http://pdfserv.maxim-ic.com/en/ds/MAX3222-MAX3241.pdf; URL: http://www.digikey.ca/product-detail/en/MAX3232CSE%2B/MAX3232CSE%2B-ND

## Sheet StepperMotor1CTRL.SchDoc: Stepper Motor Driver
size B; Date: 2015-01-23; Author: Marcin Czajkowski; Organization: Marcin Czajkowski; Address1: SN3547684; Address2: ESE-Year2; Address3: Conestoga College; Address4: Project IV; DocumentNumber: 5; Revision: A; SheetNumber: 5; SheetTotal: 14
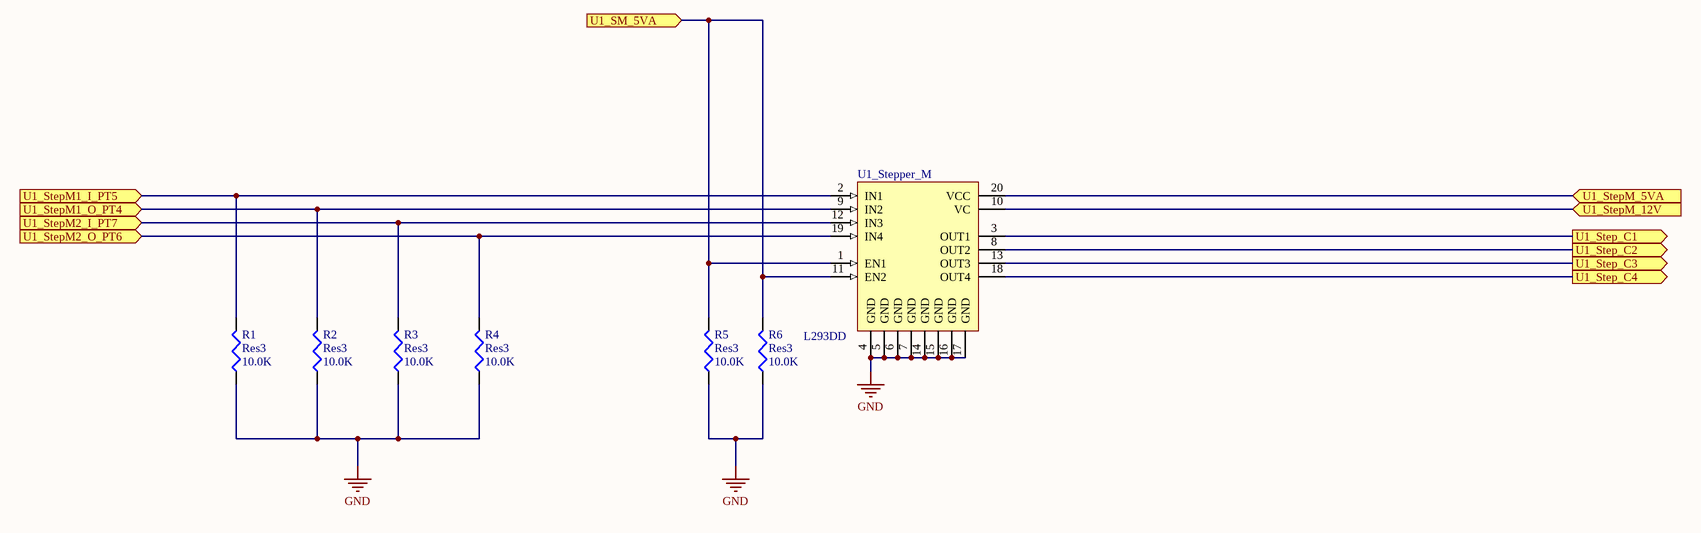
[diagram p5: StepperMotor1CTRL.SchDoc]

### Parts
R1  Res3  value 10.0K  [RESC2112X05M]
R2  Res3  value 10.0K  [RESC2112X05M]
R3  Res3  value 10.0K  [RESC2112X05M]
R4  Res3  value 10.0K  [RESC2112X05M]
R5  Res3  value 10.0K  [RESC2112X05M]
R6  Res3  value 10.0K  [RESC2112X05M]
U1_Stepper_M  L293DD  [SO20_N]

### Ports
U1_SM_5VA (in), U1_Step_C1 (out), U1_Step_C2 (out), U1_Step_C3 (out), U1_Step_C4 (out), U1_StepM1_I_PT5 (in), U1_StepM1_O_PT4 (in), U1_StepM2_I_PT7 (in), U1_StepM2_O_PT6 (in), U1_StepM_5VA (in), U1_StepM_12V (in)

### Nets
GND: R1.1 R2.1 R3.1 R4.1 R5.1 R6.1 U1_Stepper_M.4(GND) U1_Stepper_M.5(GND) U1_Stepper_M.6(GND) U1_Stepper_M.7(GND) U1_Stepper_M.14(GND) U1_Stepper_M.15(GND) U1_Stepper_M.16(GND) U1_Stepper_M.17(GND)
NetR1_2: R1.2 U1_Stepper_M.2(IN1) ; port U1_StepM1_I_PT5
NetR2_2: R2.2 U1_Stepper_M.9(IN2) ; port U1_StepM1_O_PT4
NetR3_2: R3.2 U1_Stepper_M.12(IN3) ; port U1_StepM2_I_PT7
NetR4_2: R4.2 U1_Stepper_M.19(IN4) ; port U1_StepM2_O_PT6
NetR5_2: R5.2 R6.2 U1_Stepper_M.1(EN1) U1_Stepper_M.11(EN2) ; port U1_SM_5VA
NetU1_Stepper_M_3: U1_Stepper_M.3(OUT1) ; port U1_Step_C1
NetU1_Stepper_M_8: U1_Stepper_M.8(OUT2) ; port U1_Step_C2
NetU1_Stepper_M_10: U1_Stepper_M.10(VC) ; port U1_StepM_12V
NetU1_Stepper_M_13: U1_Stepper_M.13(OUT3) ; port U1_Step_C3
NetU1_Stepper_M_18: U1_Stepper_M.18(OUT4) ; port U1_Step_C4
NetU1_Stepper_M_20: U1_Stepper_M.20(VCC) ; port U1_StepM_5VA

### Notes on the sheet
- ESE
- is the sole property of ESE. Any reproduction
- The Information Contained in this drawing
- Schematic P/N and Name
- Sheet Name
- 299 Doon Valley Drive
- Kitchener, ON N2G 4M4
- Canada
- Approved
- in part or in whole without the written
- permission of ESE is strictly prohibited.
- APPROVALS
- DATE
- Size
- Scale
- B
- NTS
- Bare PCB P/N
- Date
- Sheet
- Rev.
- Checked
- Engineer
- of

### Library data of the parts
R1-R6 = Resistor_10.0K: as R_BDM on sheet CPU; Name: Resistor_10.0K; URL: http://www.digikey.ca/product-detail/en/CRCW080510K0FKEA/541-10.0KCCT-ND
U1_Stepper_M = L293DD: Push-Pull Four Channel Driver With Diode; PN: 497-2937-1-ND; Published: 8-Jun-2000; LatestRevisionDate: 13-Apr-2006; LatestRevisionNote: IPC-7351 Footprint Added.; DatasheetVersion: Jun-1996; PackageVersion: Jul-2001; PackageReference: SO20; Publisher: Altium Limited; PackageDescription: 20-Pin Plastic Small Outline Integrated Circuit 1.27 mm Pitch; Code_JEDEC: MS-013-AC; Code_IPC: SOIC127P1030-20; ComponentLink1Description: Manufacturer Link; ComponentLink1URL: http://www.st.com/; ComponentLink2Description: Datasheet; ComponentLink2URL: http://www.st.com/stonline/products/literature/ds/1330/l293d.pdf; URL: http://www.digikey.ca/product-detail/en/L293DD013TR/497-2937-1-ND/634902

## Sheet LCD_Header.SchDoc: LCDDisplay
size B; Date: 2015-01-23; Author: Marcin Czajkowski; Organization: Marcin Czajkowski; Address1: SN: 3547684; Address2: ESE-Year2; Address3: Conestoga College; Address4: Project IV; DocumentNumber: 6; Revision: A; SheetNumber: 6; SheetTotal: 14
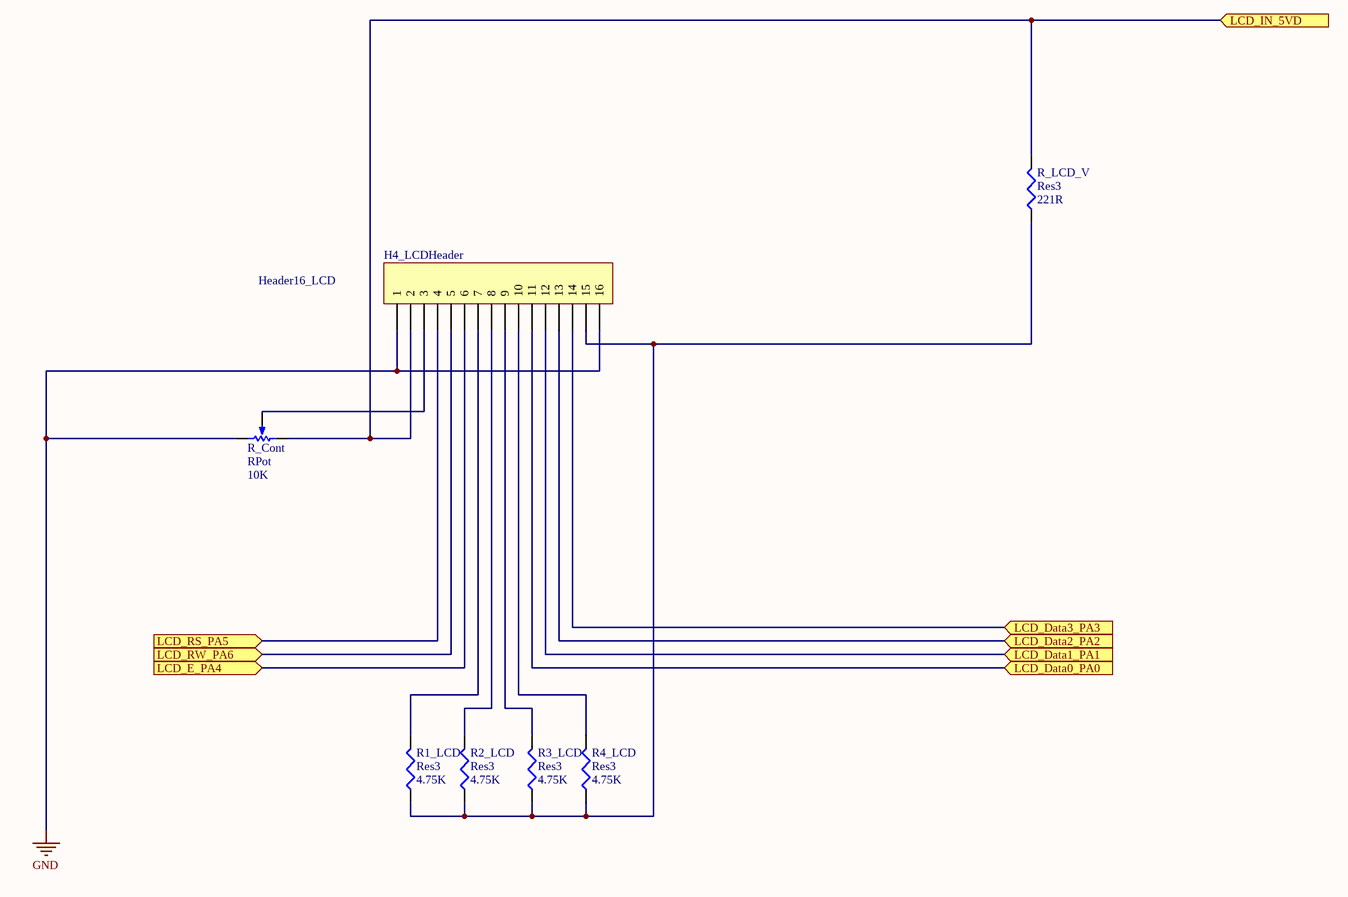
[diagram p6: LCD_Header.SchDoc]

### Parts
H4_LCDHeader  Header16_LCD  [HDR1X16_LCD]
R1_LCD  Res3  value 4.75K  [RESC2112X05M]
R2_LCD  Res3  value 4.75K  [RESC2112X05M]
R3_LCD  Res3  value 4.75K  [RESC2112X05M]
R4_LCD  Res3  value 4.75K  [RESC2112X05M]
R_Cont  RPot  value 10K  [BOURNS_3386F]
R_LCD_V  Res3  value 221R  [RESC2112X05M]

### Ports
LCD_Data0_PA0 (in), LCD_Data1_PA1 (in), LCD_Data2_PA2 (in), LCD_Data3_PA3 (in), LCD_E_PA4 (in), LCD_IN_5VD (in), LCD_RS_PA5 (in), LCD_RW_PA6 (in)

### Nets
GND: H4_LCDHeader.1 H4_LCDHeader.16 R_Cont.3(BOT)
NetH4_LCDHeader_2: H4_LCDHeader.2 R_Cont.1(TOP) R_LCD_V.2 ; port LCD_IN_5VD
NetH4_LCDHeader_3: H4_LCDHeader.3 R_Cont.2(TAP)
NetH4_LCDHeader_4: H4_LCDHeader.4 ; port LCD_RS_PA5
NetH4_LCDHeader_5: H4_LCDHeader.5 ; port LCD_RW_PA6
NetH4_LCDHeader_6: H4_LCDHeader.6 ; port LCD_E_PA4
NetH4_LCDHeader_7: H4_LCDHeader.7 R1_LCD.2
NetH4_LCDHeader_8: H4_LCDHeader.8 R2_LCD.2
NetH4_LCDHeader_9: H4_LCDHeader.9 R3_LCD.2
NetH4_LCDHeader_10: H4_LCDHeader.10 R4_LCD.2
NetH4_LCDHeader_11: H4_LCDHeader.11 ; port LCD_Data0_PA0
NetH4_LCDHeader_12: H4_LCDHeader.12 ; port LCD_Data1_PA1
NetH4_LCDHeader_13: H4_LCDHeader.13 ; port LCD_Data2_PA2
NetH4_LCDHeader_14: H4_LCDHeader.14 ; port LCD_Data3_PA3
NetH4_LCDHeader_15: H4_LCDHeader.15 R1_LCD.1 R2_LCD.1 R3_LCD.1 R4_LCD.1 R_LCD_V.1

### Notes on the sheet
- ESE
- is the sole property of ESE. Any reproduction
- The Information Contained in this drawing
- Schematic P/N and Name
- Sheet Name
- 299 Doon Valley Drive
- Kitchener, ON N2G 4M4
- Canada
- Approved
- in part or in whole without the written
- permission of ESE is strictly prohibited.
- APPROVALS
- DATE
- Size
- Scale
- B
- NTS
- Bare PCB P/N
- Date
- Sheet
- Rev.
- Checked
- Engineer
- of

### Library data of the parts
H4_LCDHeader = Header16_LCD: Header, 16-Pin Female; MPN: PPPC161LFBN-RC; PN: S7049-ND; URL: http://www.digikey.ca/product-detail/en/PPPC161LFBN-RC/S7049-ND
R1_LCD R2_LCD R3_LCD R4_LCD = Resistor_4.75K: as R_IRQ on sheet CPU; Name: Resistor_4.75K; URL: http://www.digikey.ca/product-detail/en/CRCW08054K75FKEA/541-4.75KCCT-ND
R_Cont = RPot: Potentiometer; Sim Note: Enter the Resistance value and the set point into parameter fields.; Set Position: 0.5; PN: 3352T-103LF-ND; Published: 8-Jun-2000; LatestRevisionDate: 17-Jul-2002; LatestRevisionNote: Re-released for DXP Platform.; PackageReference: VR5; Publisher: Altium Limited; PackageDescription: Variable Resistor, Thru-Hole; 3 Leads; URL: http://www.digikey.ca/product-detail/en/3352T-1-103LF/3352T-103LF-ND/1088341
R_LCD_V = Resistor_221R: RES SMD 221R OHM 1% 1/8W 0805; MPN: CRCW0805221RFKEA; PN: 541-221CCT-ND; Name: Resistor_221R; URL: http://www.digikey.ca/product-detail/en/CRCW0805221RFKEA/541-221CCT-ND

## Sheet DCMotor1CTRL.SchDoc: DC Motor Driver
size B; Date: 2015-01-23; Author: Marcin Czajkowski; Organization: Marcin Czajkowski; Address1: SN: 3547684; Address2: ESE-Year2; Address3: Conestoga Project; Address4: Project IV; DocumentNumber: 7; Revision: A; SheetNumber: 7; SheetTotal: 14
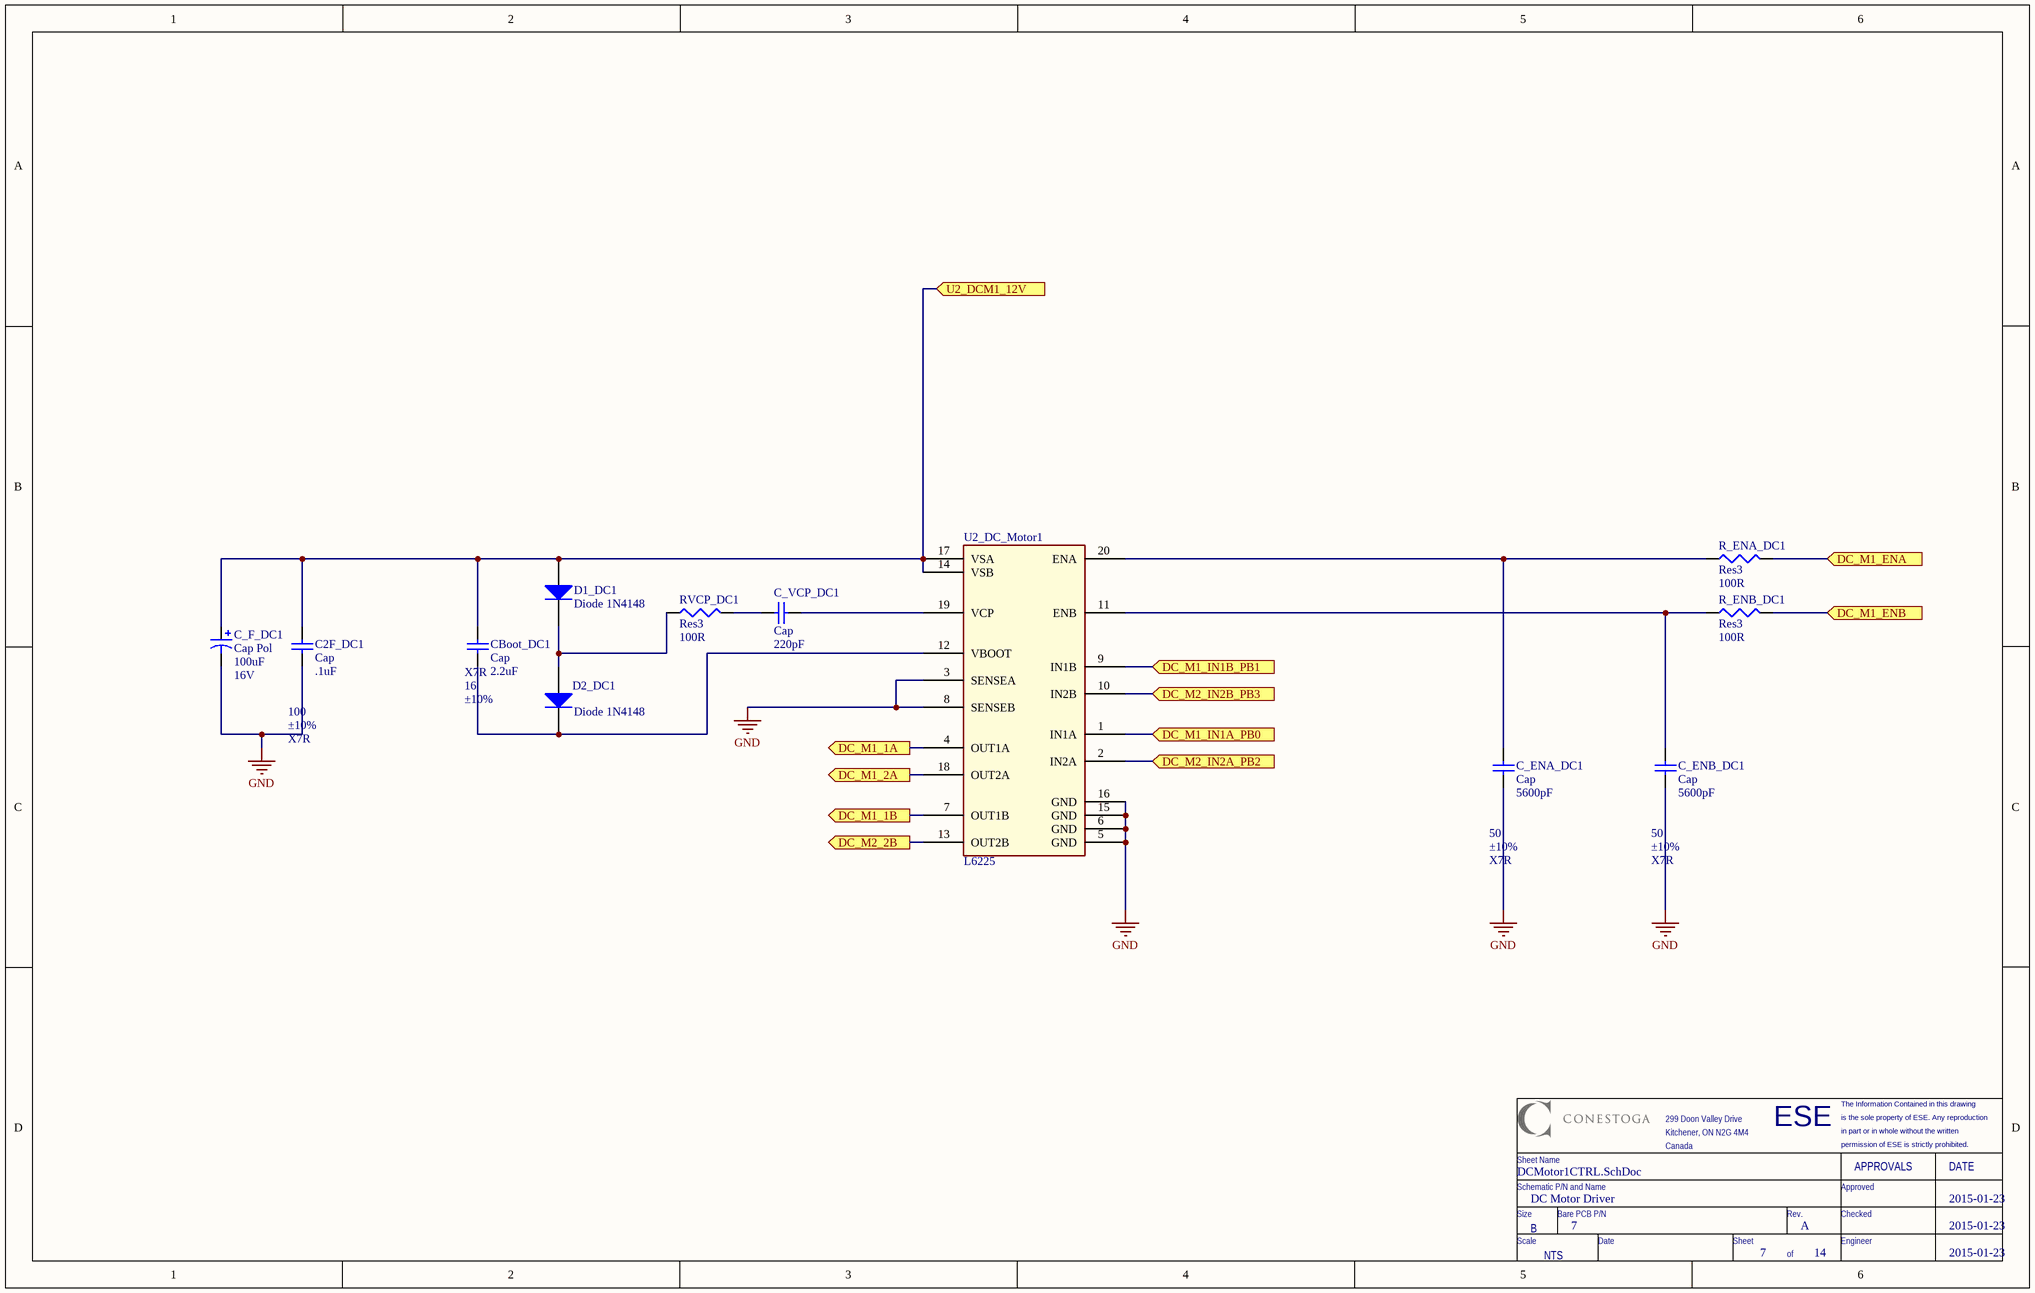
[diagram p7: DCMotor1CTRL.SchDoc]

### Parts
C2F_DC1  Cap  value .1uF  WV: 100  Tolerance: ±10%  Type: X7R  [CAPC2012X09M]
C_ENA_DC1  Cap  value 5600pF  WV: 50  Tolerance: ±10%  Type: X7R  [CAPC2012X09M]
C_ENB_DC1  Cap  value 5600pF  WV: 50  Tolerance: ±10%  Type: X7R  [CAPC2012X09M]
C_F_DC1  Cap Pol  value 100uF  Voltage: 16V  [CAPACITOR_6.3MM]
C_VCP_DC1  Cap  value 220pF  [CAPC2012X09M]
CBoot_DC1  Cap  value 2.2uF  WV: 16  Tolerance: ±10%  Type: X7R  [CAPC2012X09M]
D1_DC1  Diode 1N4148  [zener_sod323]
D2_DC1  Diode 1N4148  [zener_sod323]
R_ENA_DC1  Res3  value 100R  [RESC2112X05M]
R_ENB_DC1  Res3  value 100R  [RESC2112X05M]
RVCP_DC1  Res3  value 100R  [RESC2112X05M]
U2_DC_Motor1  L6225  [POWERSOP20]

### Ports
DC_M1_1A (out), DC_M1_1B (out), DC_M1_2A (out), DC_M1_ENA (in), DC_M1_ENB (in), DC_M1_IN1A_PB0 (in), DC_M1_IN1B_PB1 (in), DC_M2_2B (out), DC_M2_IN2A_PB2 (in), DC_M2_IN2B_PB3 (in), U2_DCM1_12V (in)

### Nets
GND: C2F_DC1.1 C_ENA_DC1.1 C_ENB_DC1.1 C_F_DC1.2 U2_DC_Motor1.3(SENSEA) U2_DC_Motor1.5(GND) U2_DC_Motor1.6(GND) U2_DC_Motor1.8(SENSEB) U2_DC_Motor1.15(GND) U2_DC_Motor1.16(GND)
NetC2F_DC1_2: C2F_DC1.2 C_F_DC1.1 CBoot_DC1.2 D1_DC1.A U2_DC_Motor1.14(VSB) U2_DC_Motor1.17(VSA) ; port U2_DCM1_12V
NetC_ENA_DC1_2: C_ENA_DC1.2 R_ENA_DC1.1 U2_DC_Motor1.20(ENA)
NetC_ENB_DC1_2: C_ENB_DC1.2 R_ENB_DC1.1 U2_DC_Motor1.11(ENB)
NetC_VCP_DC1_1: C_VCP_DC1.1 RVCP_DC1.2
NetC_VCP_DC1_2: C_VCP_DC1.2 U2_DC_Motor1.19(VCP)
NetCBoot_DC1_1: CBoot_DC1.1 D2_DC1.K U2_DC_Motor1.12(VBOOT)
NetD1_DC1_K: D1_DC1.K D2_DC1.A RVCP_DC1.1
NetR_ENA_DC1_2: R_ENA_DC1.2 ; port DC_M1_ENA
NetR_ENB_DC1_2: R_ENB_DC1.2 ; port DC_M1_ENB
NetU2_DC_Motor1_1: U2_DC_Motor1.1(IN1A) ; port DC_M1_IN1A_PB0
NetU2_DC_Motor1_2: U2_DC_Motor1.2(IN2A) ; port DC_M2_IN2A_PB2
NetU2_DC_Motor1_4: U2_DC_Motor1.4(OUT1A) ; port DC_M1_1A
NetU2_DC_Motor1_7: U2_DC_Motor1.7(OUT1B) ; port DC_M1_1B
NetU2_DC_Motor1_9: U2_DC_Motor1.9(IN1B) ; port DC_M1_IN1B_PB1
NetU2_DC_Motor1_10: U2_DC_Motor1.10(IN2B) ; port DC_M2_IN2B_PB3
NetU2_DC_Motor1_13: U2_DC_Motor1.13(OUT2B) ; port DC_M2_2B
NetU2_DC_Motor1_18: U2_DC_Motor1.18(OUT2A) ; port DC_M1_2A

### Notes on the sheet
- ESE
- is the sole property of ESE. Any reproduction
- The Information Contained in this drawing
- Schematic P/N and Name
- Sheet Name
- 299 Doon Valley Drive
- Kitchener, ON N2G 4M4
- Canada
- Approved
- in part or in whole without the written
- permission of ESE is strictly prohibited.
- APPROVALS
- DATE
- Size
- Scale
- B
- NTS
- Bare PCB P/N
- Date
- Sheet
- Rev.
- Checked
- Engineer
- of

### Library data of the parts
C2F_DC1 = CAP-X7R-.1uF-100V-±10%: CAP CER .1uF 100v X7R 0805; MPN: C0805C104K1RACTU; PN: 399-3486-1-ND; Name: CAP-X7R-.1uF-100V-±10%; URL: http://www.digikey.ca/product-detail/en/C0805C104K1RACTU/399-3486-1-ND
C_ENA_DC1 C_ENB_DC1 = CAP-X7R-5600pF-50V-±10%: CAP CER 5600pF 50v X7R 0805; MPN: C0805C562K5RACTU; PN: 399-1156-1-ND; Name: CAP-X7R-5600pF-50V-±10%; URL: http://www.digikey.ca/product-detail/en/C0805C562K5RACTU/399-1156-1-ND
C_F_DC1 = Cap Polar-100uF-16V: CAP 85C 100uF ±20% 16V WX Series Aluminum Electrolytic; MPN: UWX1C101MCL1GB; Tan Theta: 0.16; Leakage Current: 16; Rated Ripple Current: 86; PN: 493-2105-1-ND; Name: Cap Polar-100uF-16V; Diameter: 6.3; URL: http://www.digikey.ca/product-detail/en/UWX1C101MCL1GB/493-2105-1-ND
C_VCP_DC1 = CAP-COG-220pF-50V-±5%: CAP CER 220pF 50v COG 0805; MPN: C0805C221J5GACTU; PN: 399-1127-1-ND; Name: CAP-COG-220pF-50V-±5%; URL: http://www.digikey.ca/product-detail/en/C0805C221J5GACTU/399-1127-1-ND
CBoot_DC1 = CAP-X7R-2.2uF-16V-±10%: as Cin_D on sheet SMPS_5V_D; Name: CAP-X7R-2.2uF-16V-±10%; URL: http://www.digikey.ca/product-detail/en/C0805C225K4RACTU/399-3523-1-ND
D1_DC1 D2_DC1 = Diode 1N4148: High Conductance Fast Diode; PN: 1N4148WXTPMSCT-ND; URL: http://www.digikey.ca/product-detail/en/1N4148WX-TP/1N4148WXTPMSCT-ND/717312
R_ENA_DC1 R_ENB_DC1 RVCP_DC1 = Resistor_100R: RES SMD 100R OHM 1% 1/8W 0805; MPN: CRCW0805100RFKEA; PN: 541-100CCT-ND; Name: Resistor_100R; URL: http://www.digikey.ca/product-detail/en/CRCW0805100RFKEA/541-100CCT-ND
U2_DC_Motor1 = L6225: IC MOTOR DRIVER PAR 20POWERSO; MPN: L6225PDTR; PN: 497-5345-1-ND; URL: http://www.digikey.ca/product-detail/en/L6225PDTR/497-5345-1-ND

## Sheet Encoder_DC_Mot.SchDoc: DC Motor Speed Encoder
size B; Date: 2015-01-23; Author: Marcin Czajkowski; Organization: Marcin Czajkowski; Address1: SN: 3547684; Address2: ESE-Year2; Address3: Conestoga College; Address4: Project IV; DocumentNumber: 9; Revision: B; SheetNumber: 9; SheetTotal: 14
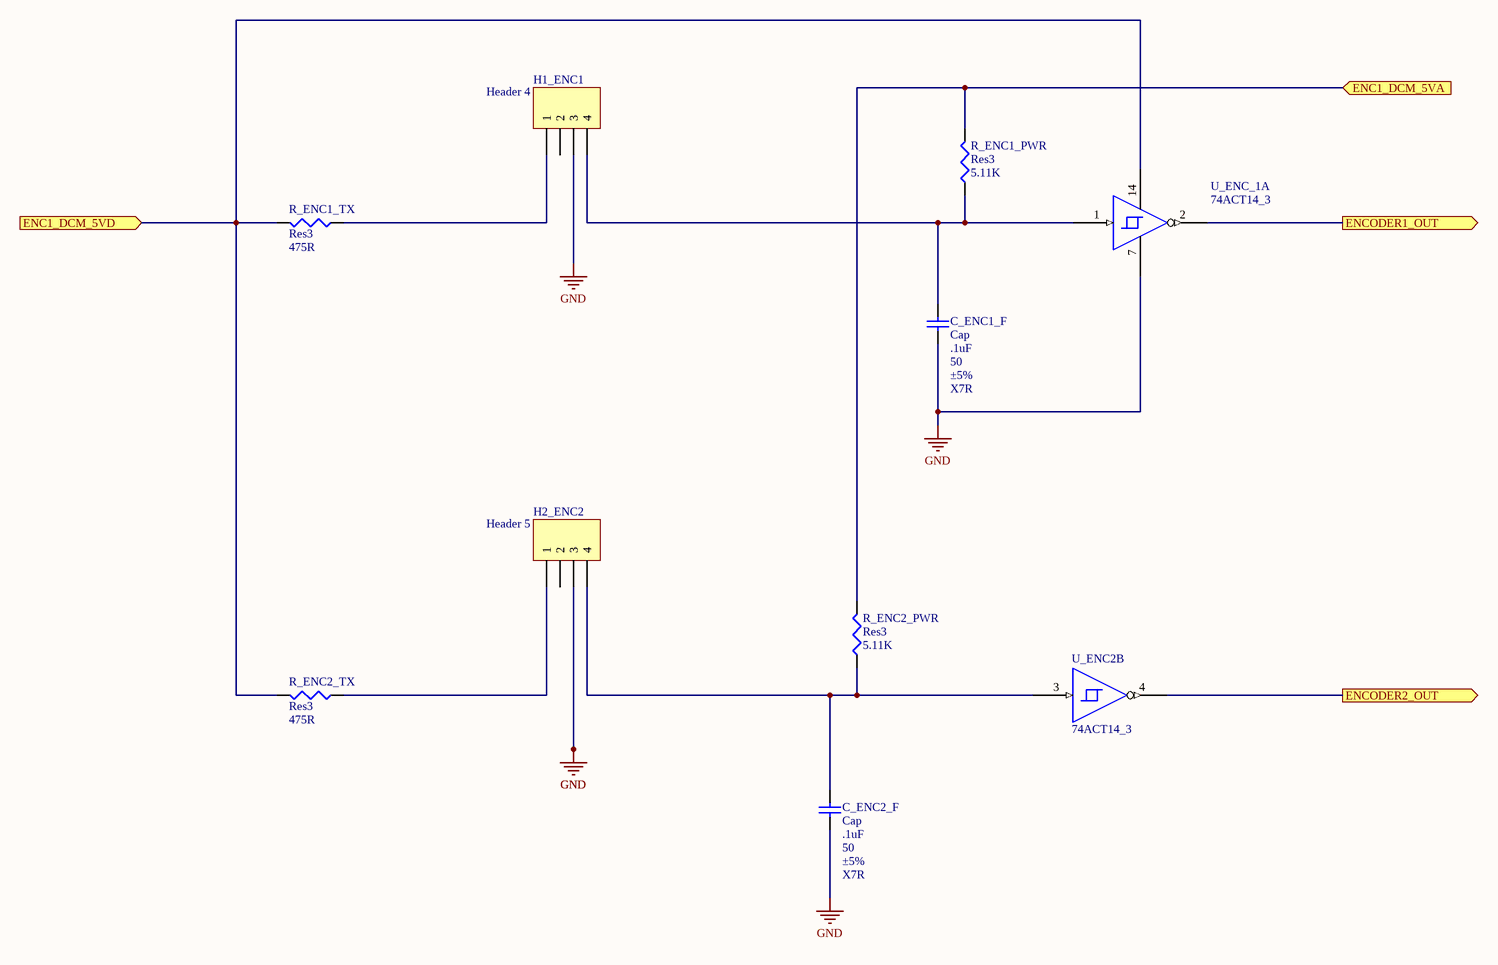
[diagram p8: Encoder_DC_Mot.SchDoc]

### Parts
C_ENC1_F  Cap  value .1uF  WV: 50  Tolerance: ±5%  Type: X7R  [CAPC2012X09M]
C_ENC2_F  Cap  value .1uF  WV: 50  Tolerance: ±5%  Type: X7R  [CAPC2012X09M]
H1_ENC1  Header 4  [HDR1X4]
H2_ENC2  Header 5  [HDR1X4]
R_ENC1_PWR  Res3  value 5.11K  [RESC2112X05M]
R_ENC1_TX  Res3  value 475R  [RESC2112X05M]
R_ENC2_PWR  Res3  value 5.11K  [RESC2112X05M]
R_ENC2_TX  Res3  value 475R  [RESC2112X05M]
U_ENC2  74ACT14_3  [SOIC127P600X175-14M]  (part B of 6)
U_ENC_1  74ACT14_3  [SOIC127P600X175-14M]  (part A of 6)

### Ports
ENC1_DCM_5VA (in), ENC1_DCM_5VD (in), ENCODER1_OUT (out), ENCODER2_OUT (out)

### Nets
GND: C_ENC1_F.1 C_ENC2_F.1 H1_ENC1.3 H2_ENC2.3 U_ENC_1.7(GND_POWER)
NetC_ENC1_F_2: C_ENC1_F.2 H1_ENC1.4 R_ENC1_PWR.1 U_ENC_1.1(A)
NetC_ENC2_F_2: C_ENC2_F.2 H2_ENC2.4 R_ENC2_PWR.1 U_ENC2.3(A)
NetH1_ENC1_1: H1_ENC1.1 R_ENC1_TX.1
NetH2_ENC2_1: H2_ENC2.1 R_ENC2_TX.1
NetR_ENC1_PWR_2: R_ENC1_PWR.2 R_ENC2_PWR.2 ; port ENC1_DCM_5VA
NetR_ENC1_TX_2: R_ENC1_TX.2 R_ENC2_TX.2 U_ENC_1.14(VCC) ; port ENC1_DCM_5VD
NetU_ENC2_4: U_ENC2.4(Y) ; port ENCODER2_OUT
NetU_ENC_1_2: U_ENC_1.2(Y) ; port ENCODER1_OUT

Not connected (* = marked no-connect by the designer): H1_ENC1 2; H2_ENC2 2

### Notes on the sheet
- ESE
- is the sole property of ESE. Any reproduction
- The Information Contained in this drawing
- Schematic P/N and Name
- Sheet Name
- 299 Doon Valley Drive
- Kitchener, ON N2G 4M4
- Canada
- Approved
- in part or in whole without the written
- permission of ESE is strictly prohibited.
- APPROVALS
- DATE
- Size
- Scale
- B
- NTS
- Bare PCB P/N
- Date
- Sheet
- Rev.
- Checked
- Engineer
- of

### Library data of the parts
C_ENC1_F C_ENC2_F = CAP-X7R-.1uF-50V-±5%: as C_VDD1 on sheet CPU; Name: CAP-X7R-.1uF-50V-±5%; URL: http://www.digikey.ca/product-detail/en/C0805C104J5RACTU/399-1171-1-ND
H1_ENC1 H2_ENC2 = Header 4: Header, 4-Pin; MPN: PEC04SFAN; PN: S1212E-04-ND; URL: http://www.digikey.ca/product-detail/en/PEC04SFAN/S1212E-04-ND
R_ENC1_PWR R_ENC2_PWR = Resistor_5.11K: as RX1 on sheet CPU; Name: Resistor_5.11K; URL: http://www.digikey.ca/product-detail/en/CRCW08055K11FKEA/541-5.11KCCT-ND
R_ENC1_TX R_ENC2_TX = Resistor_475R: RES SMD 475R OHM 1% 1/8W 0805; MPN: CRCW0805475RFKEA; PN: 541-475CCT-ND; Name: Resistor_475R; URL: http://www.digikey.ca/product-detail/en/CRCW0805475RFKEA/541-475CCT-ND
U_ENC2 U_ENC_1 = 74ACT14_3: IC INVERTER HEX SCHMITT 14SOIC; MPN: 74ACT14SCX; PN: 74ACT14SCXCT-ND; URL: http://www.digikey.ca/product-detail/en/74ACT14SCX/74ACT14SCXCT-ND

## Sheet LVR_3V3_PS.SchDoc: 3V3 Linear Voltage Regulator
size B; Date: 2015-01-30; Author: Marcin Czajkowski; Organization: Marcin Czajkowski; Address1: SN:3547684; Address2: ESE-Year2; Address3: Conestoga College; Address4: Project IV; DocumentNumber: 1; Revision: A; SheetNumber: 10; SheetTotal: 14
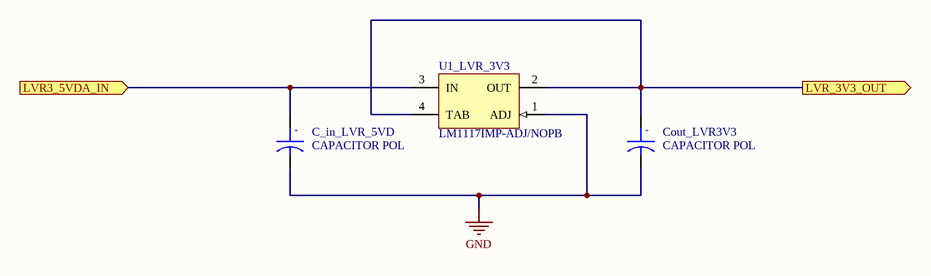
[diagram p9: LVR_3V3_PS.SchDoc]

### Parts
C_in_LVR_5VD  CAPACITOR POL
Cout_LVR3V3  CAPACITOR POL
U1_LVR_3V3  LM1117IMP-ADJ/NOPB  [MP04A_L]

### Ports
LVR3_5VDA_IN (in), LVR_3V3_OUT (out)

### Nets
GND: C_in_LVR_5VD.2 Cout_LVR3V3.2 U1_LVR_3V3.1(ADJ)
NetC_in_LVR_5VD_1: C_in_LVR_5VD.1 U1_LVR_3V3.3(IN) ; port LVR3_5VDA_IN
NetCout_LVR3V3_1: Cout_LVR3V3.1 U1_LVR_3V3.2(OUT) U1_LVR_3V3.4(TAB) ; port LVR_3V3_OUT

### Notes on the sheet
- ESE
- is the sole property of ESE. Any reproduction
- The Information Contained in this drawing
- Schematic P/N and Name
- Sheet Name
- 299 Doon Valley Drive
- Kitchener, ON N2G 4M4
- Canada
- Approved
- in part or in whole without the written
- permission of ESE is strictly prohibited.
- APPROVALS
- DATE
- Size
- Scale
- B
- NTS
- Bare PCB P/N
- Date
- Sheet
- Rev.
- Checked
- Engineer
- of
- (in symbol CAPACITOR POL) +

### Library data of the parts
U1_LVR_3V3 = LM1117IMP-ADJ/NOPB: 800mA Low-Dropout Linear Regulator, 4-pin SOT-223, Pb-Free; Manufacturer: National Semiconductor; MPN: LM1117MP-3.3/NOPB; PackageTopMarking: XYTT*N03B; PowerWise: N; CompType: LDO IC; PN: LM1117MP-3.3/NOPBCT-ND; Published: 1-Mar-2010; DatasheetVersion: Apr-2006; PackageVersion: revB, Apr-2003; PackageReference: MP04A; Publisher: Altium Limited; PackageDescription: Molded SOT-223, 6.50 x 3.56 x 1.6mm Body, 4 Lead, 2.3mm Pitch; Supplier 1: Digi-Key; Supplier Part Number 1: LM1117IMP-ADJTR-ND; Supplier 2: Digi-Key; Supplier Part Number 2: LM1117IMP-ADJCT-ND; Supplier 3: Digi-Key; Supplier Part Number 3: LM1117IMP-ADJDKR-ND; Supplier 4: Farnell; Supplier Part Number 4: 1469050; PartNumber: LM1117IMP-ADJ/NOPB; RoHS: Y; PinCount: 4; Code_JEDEC: TO-261-AA; Code_IPC: SOT223-4; ComponentLink1Description: LM1117 Datasheet; ComponentLink1URL: http://www.national.com/ds/LM/LM1117.pdf; ComponentLink2Description: LM1117 Web Page; ComponentLink2URL: http://www.national.com/pf/LM/LM1117.html; ComponentLink3Description: MP04A Package Page; ComponentLink3URL: http://www.national.com/packaging/folders/mp04a.html; URL: http://www.digikey.ca/product-detail/en/LM1117MP-3.3%2FNOPB/LM1117MP-3.3%2FNOPBCT-ND